# EAGLE schematic moteus_n1 (EAGLE 9.6.0)
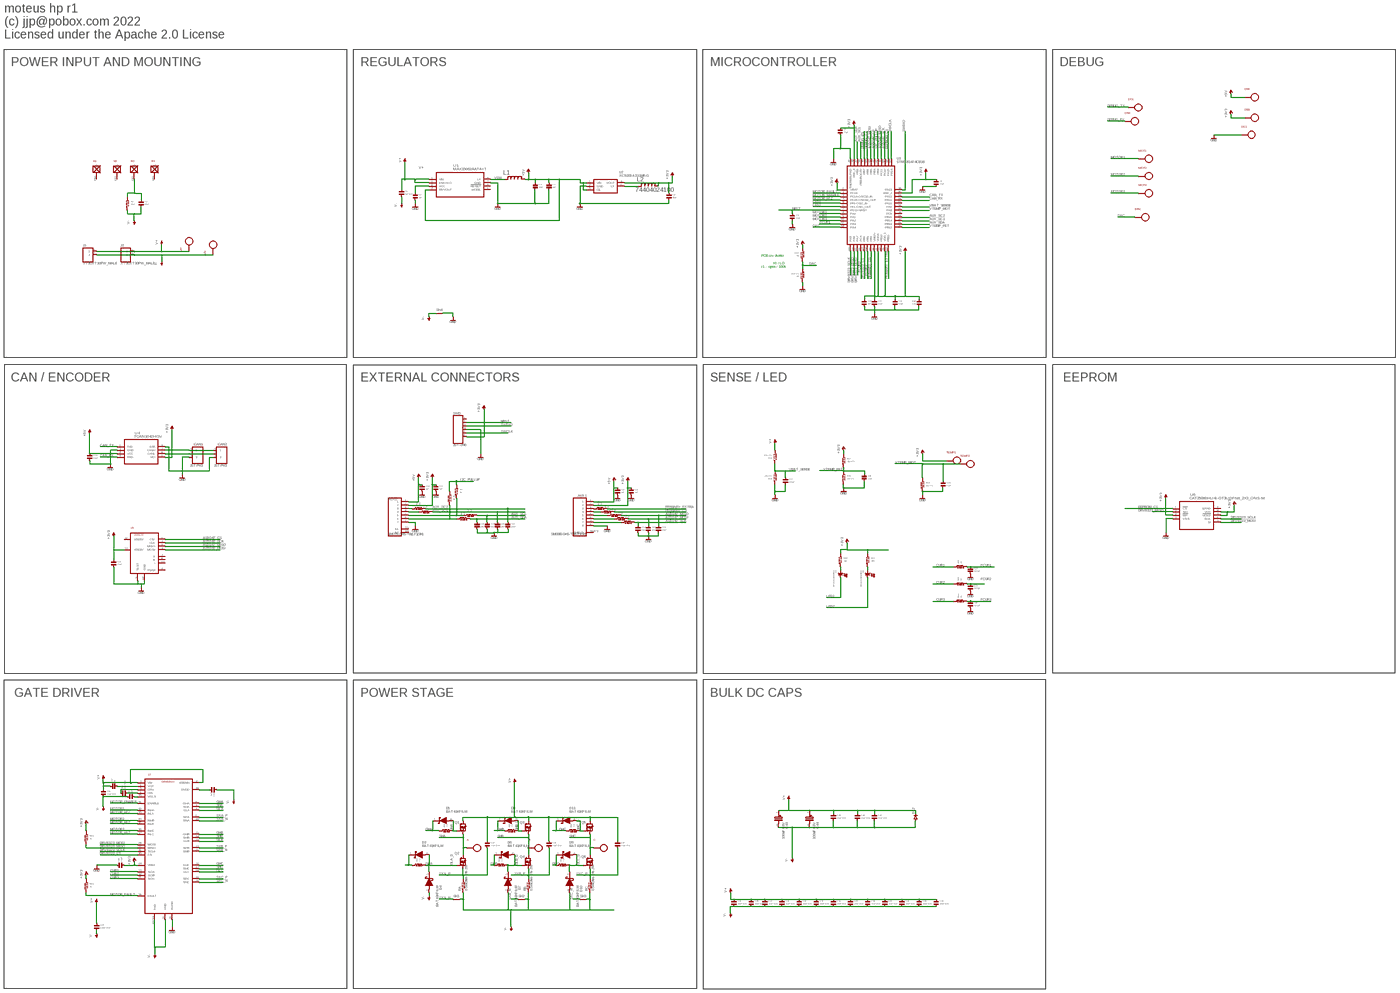
[diagram p0: schematic, sheet 1, overview]
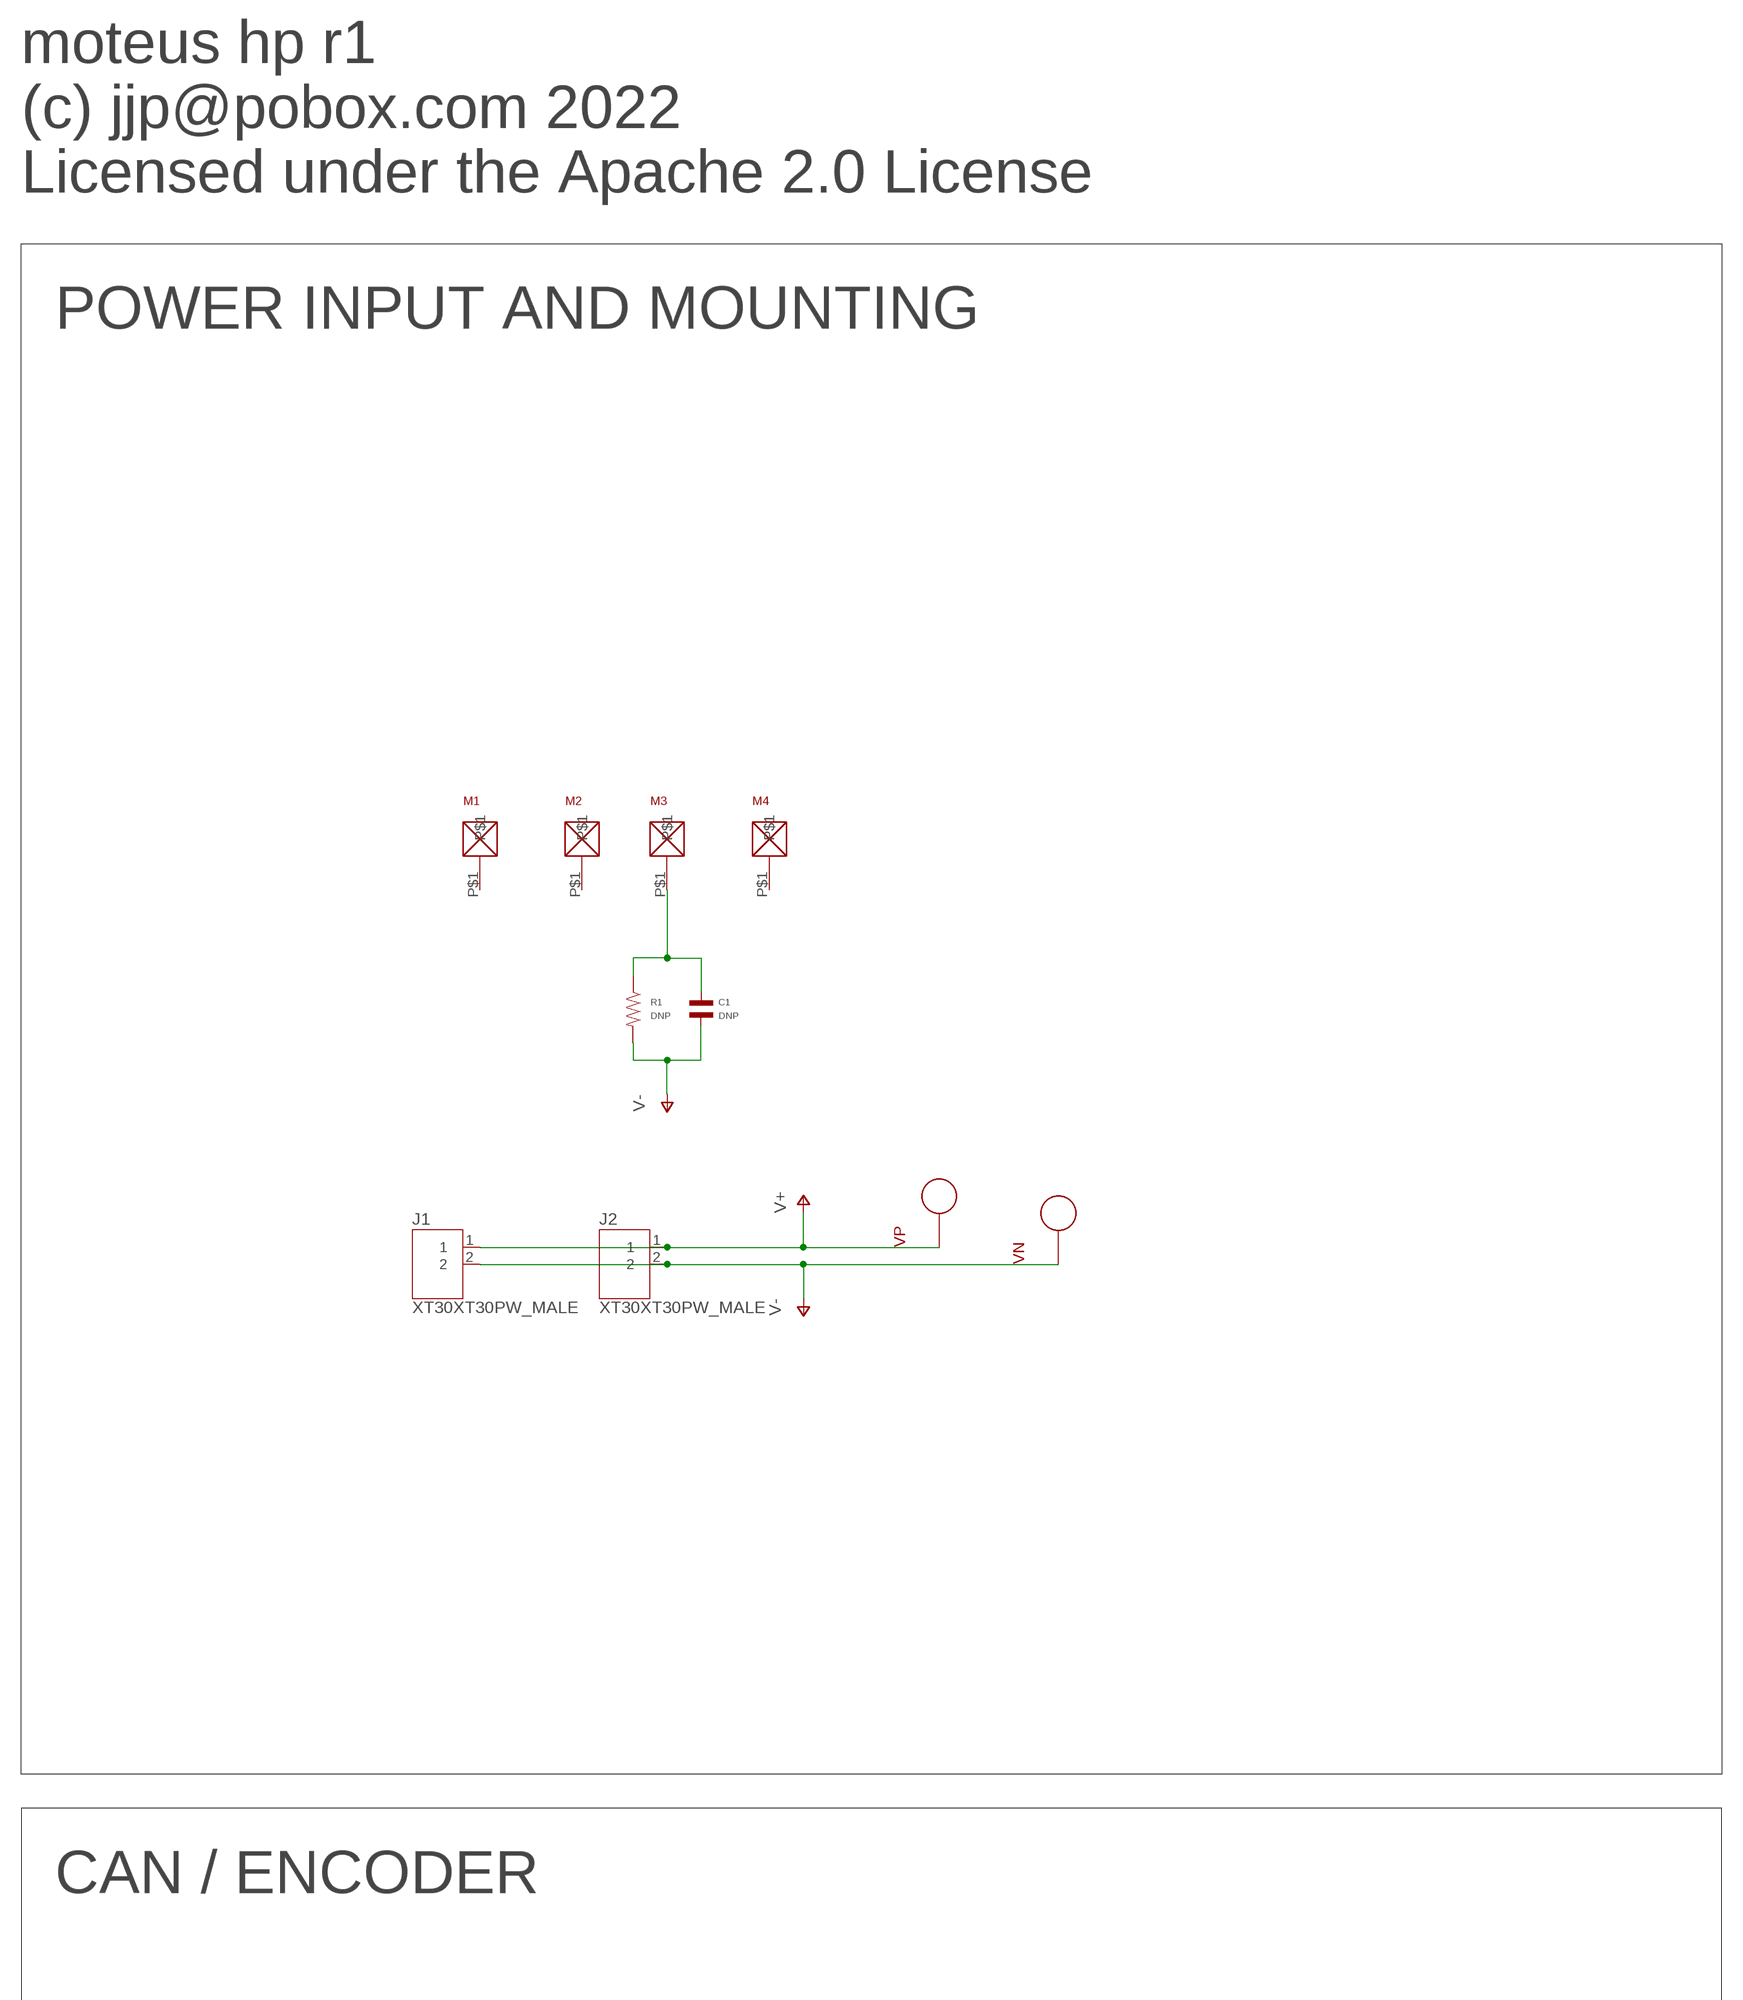
[diagram p1: schematic, sheet 1, part 1 of 8]
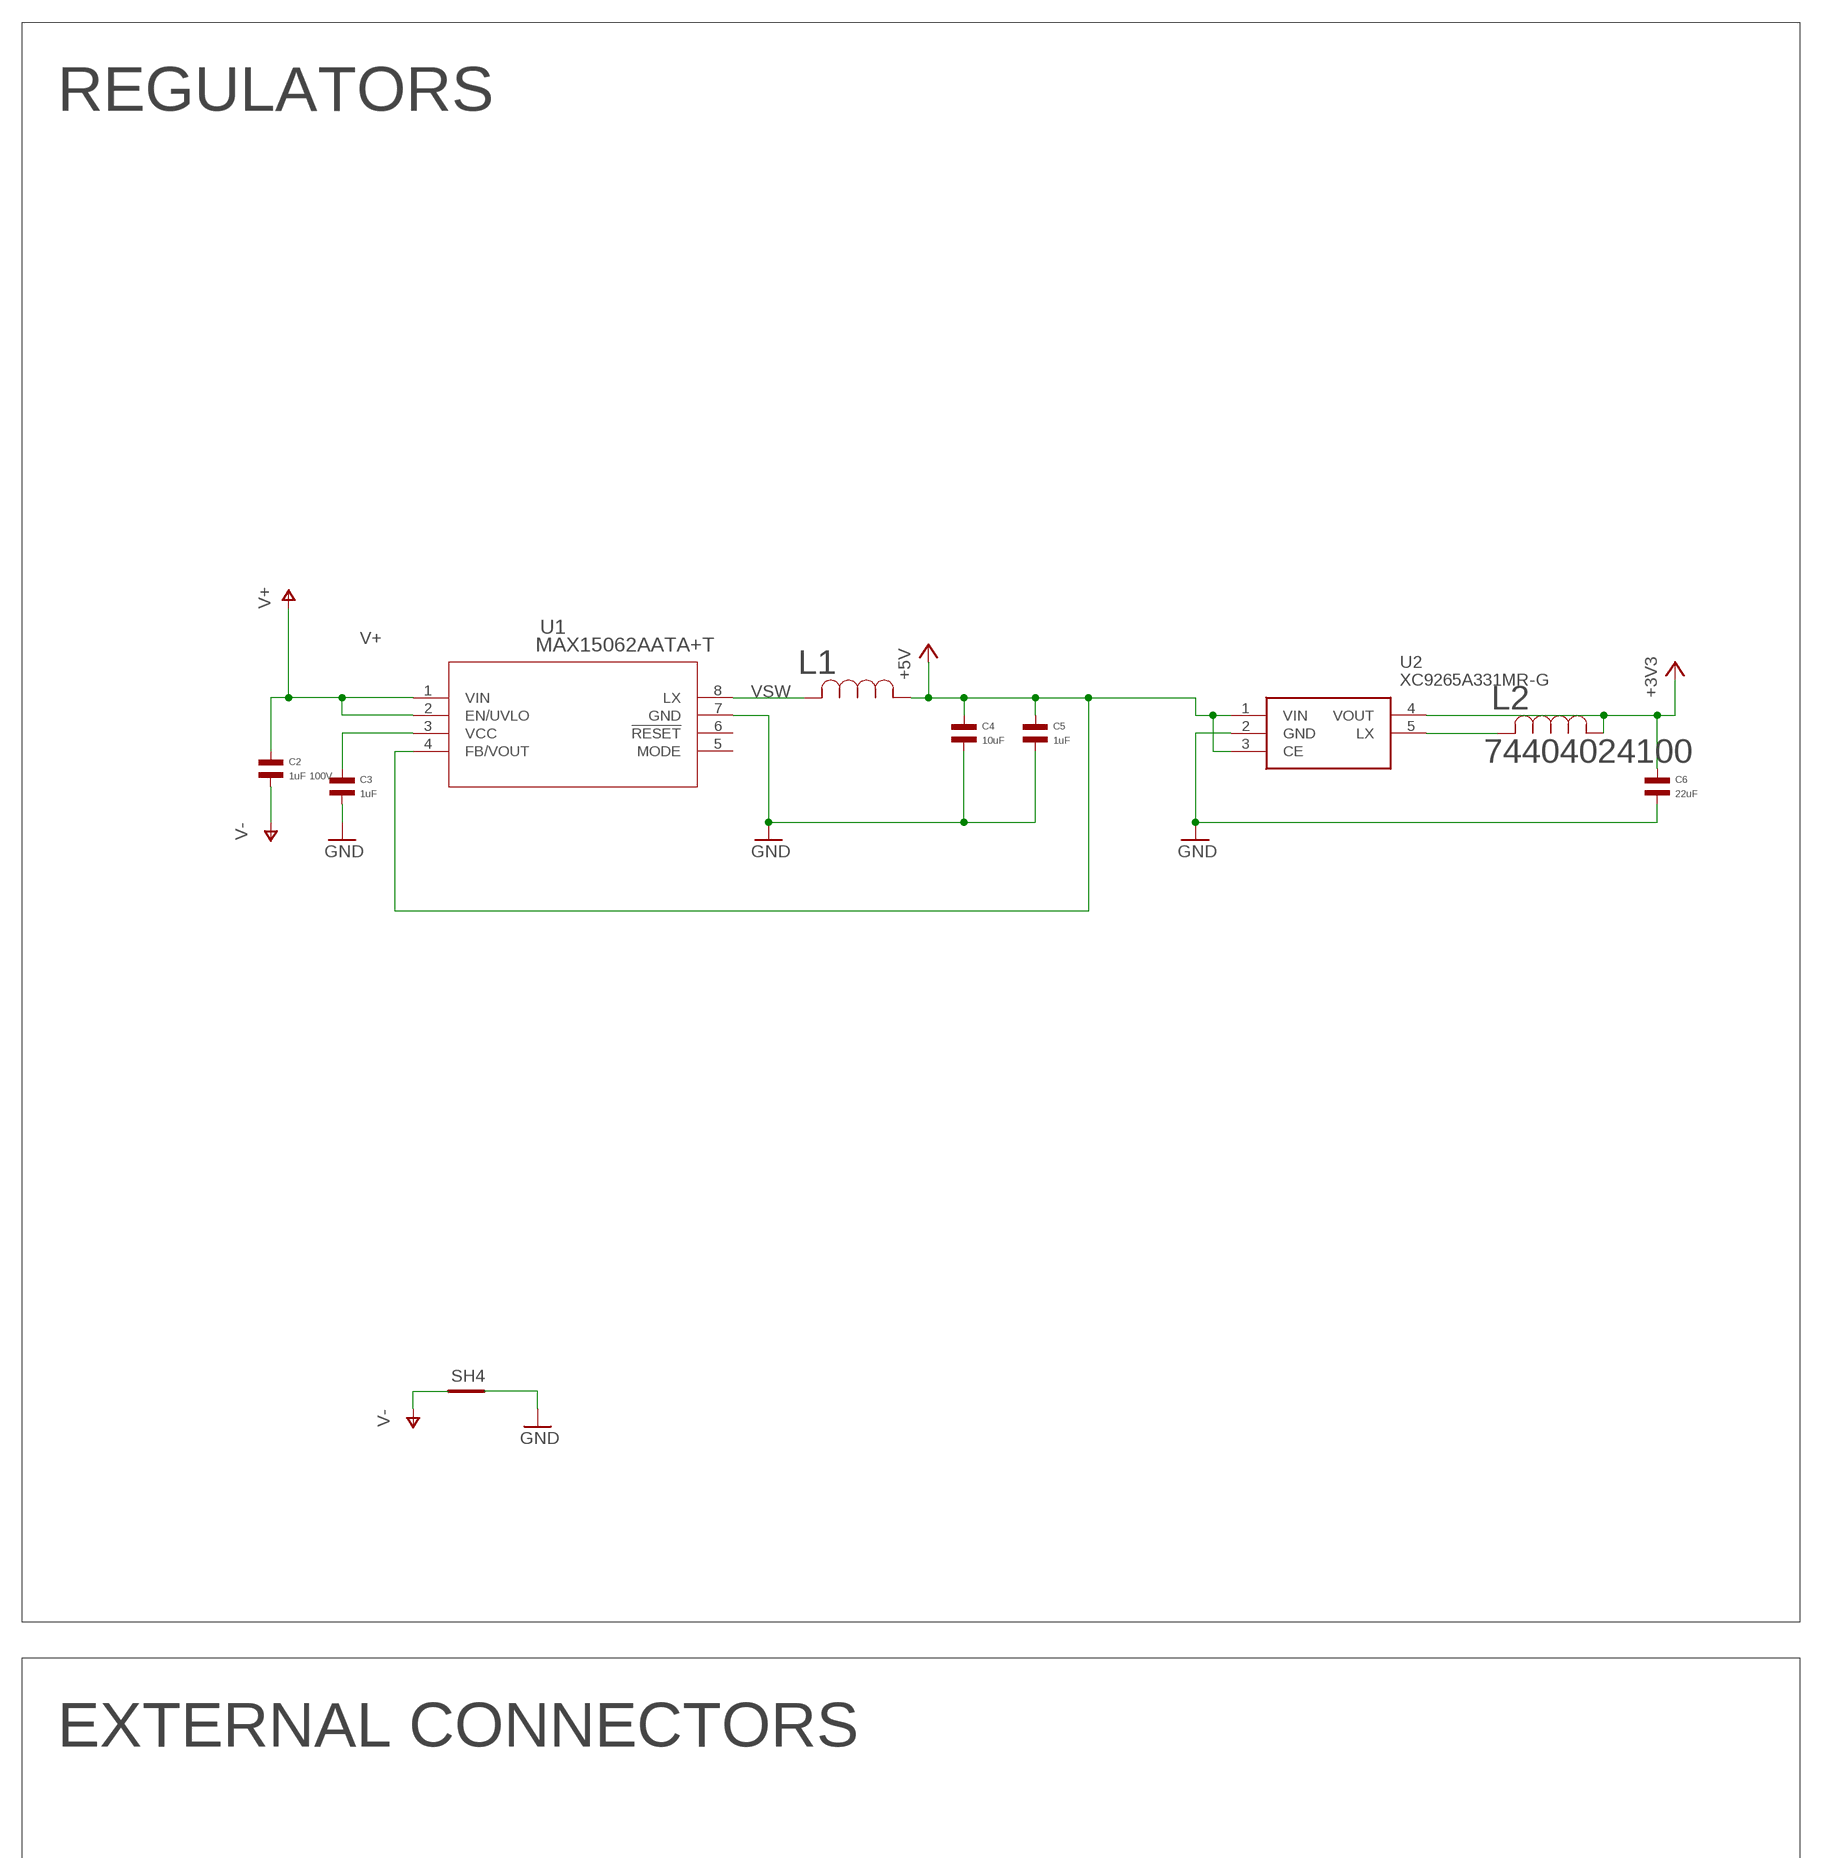
[diagram p2: schematic, sheet 1, part 2 of 8]
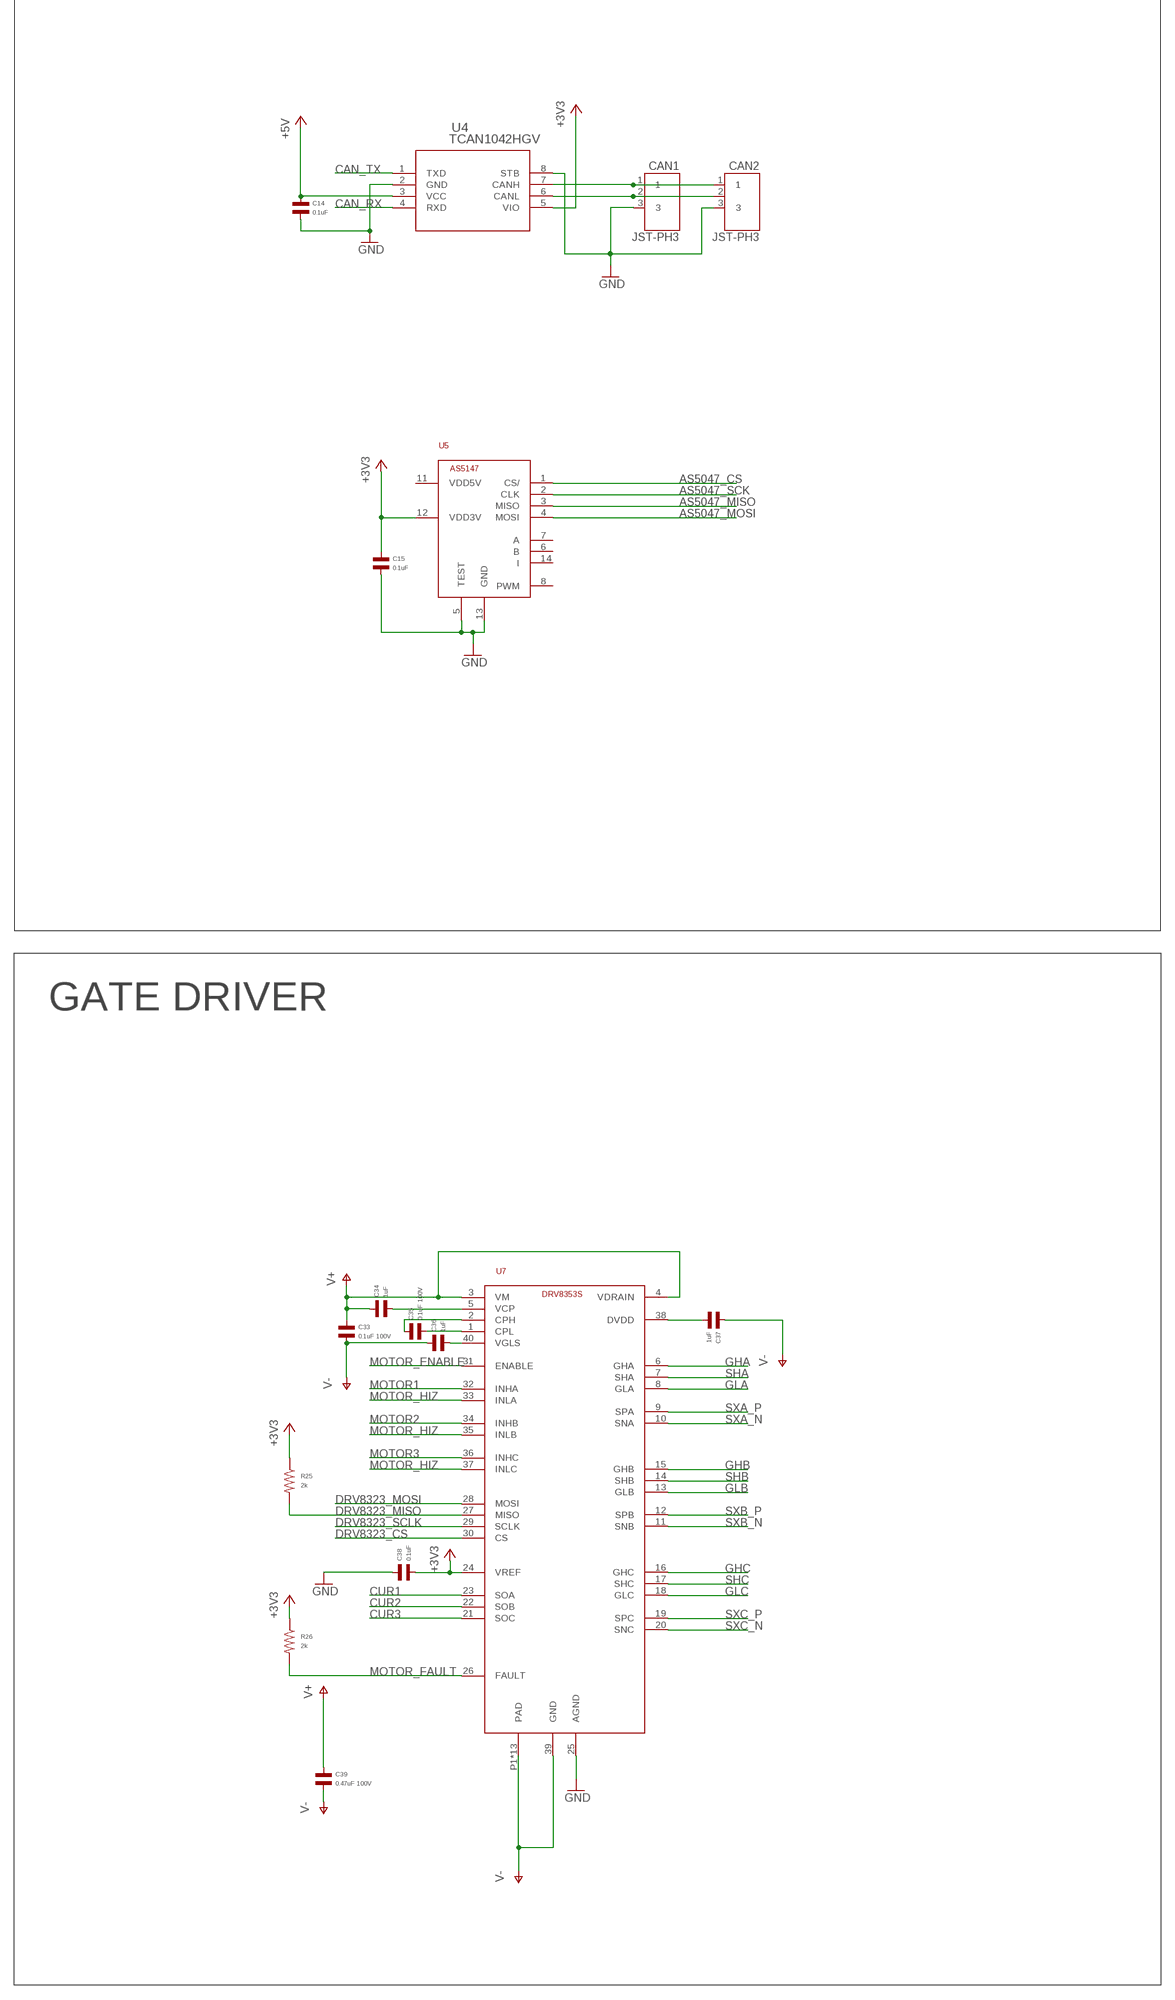
[diagram p3: schematic, sheet 1, part 3 of 8]
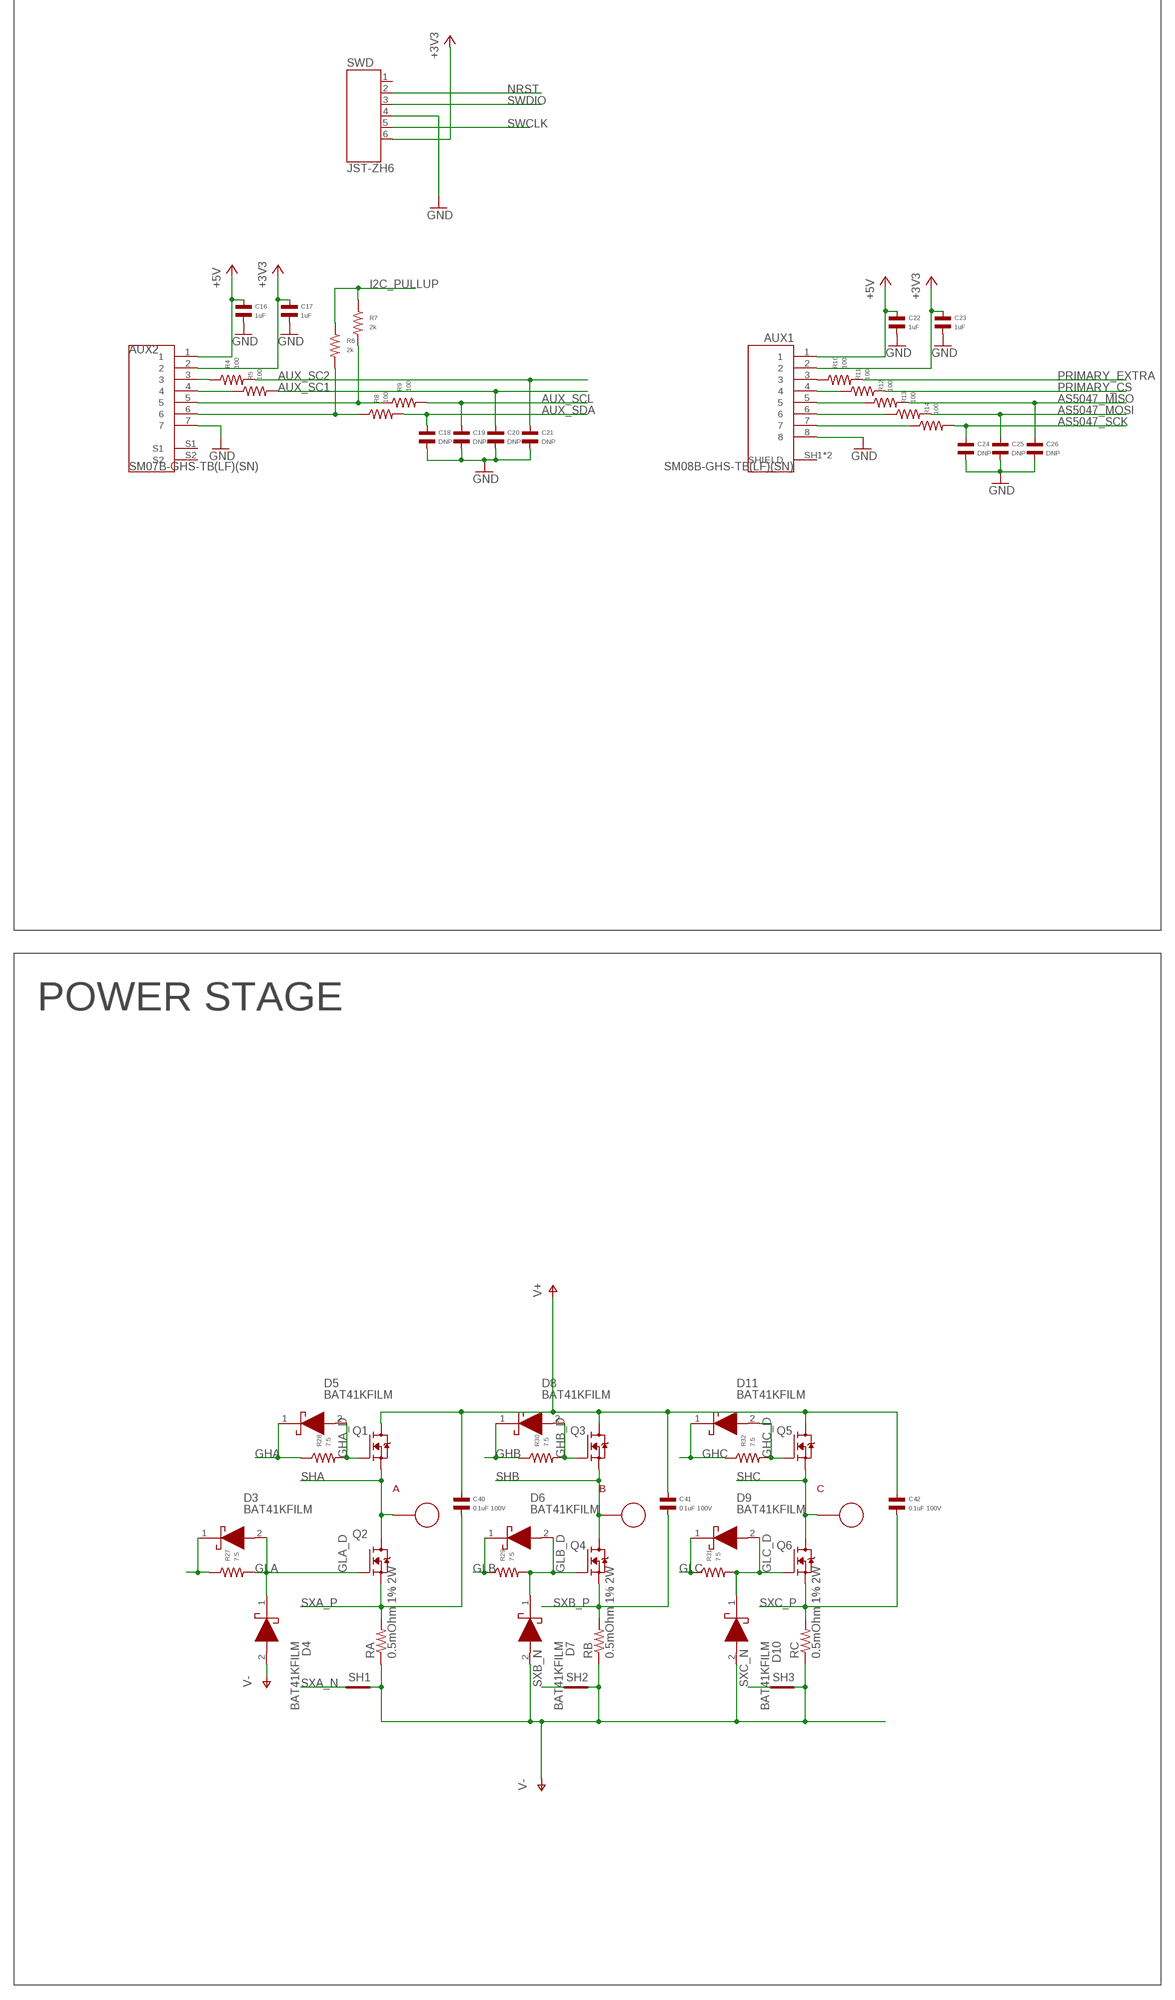
[diagram p4: schematic, sheet 1, part 4 of 8]
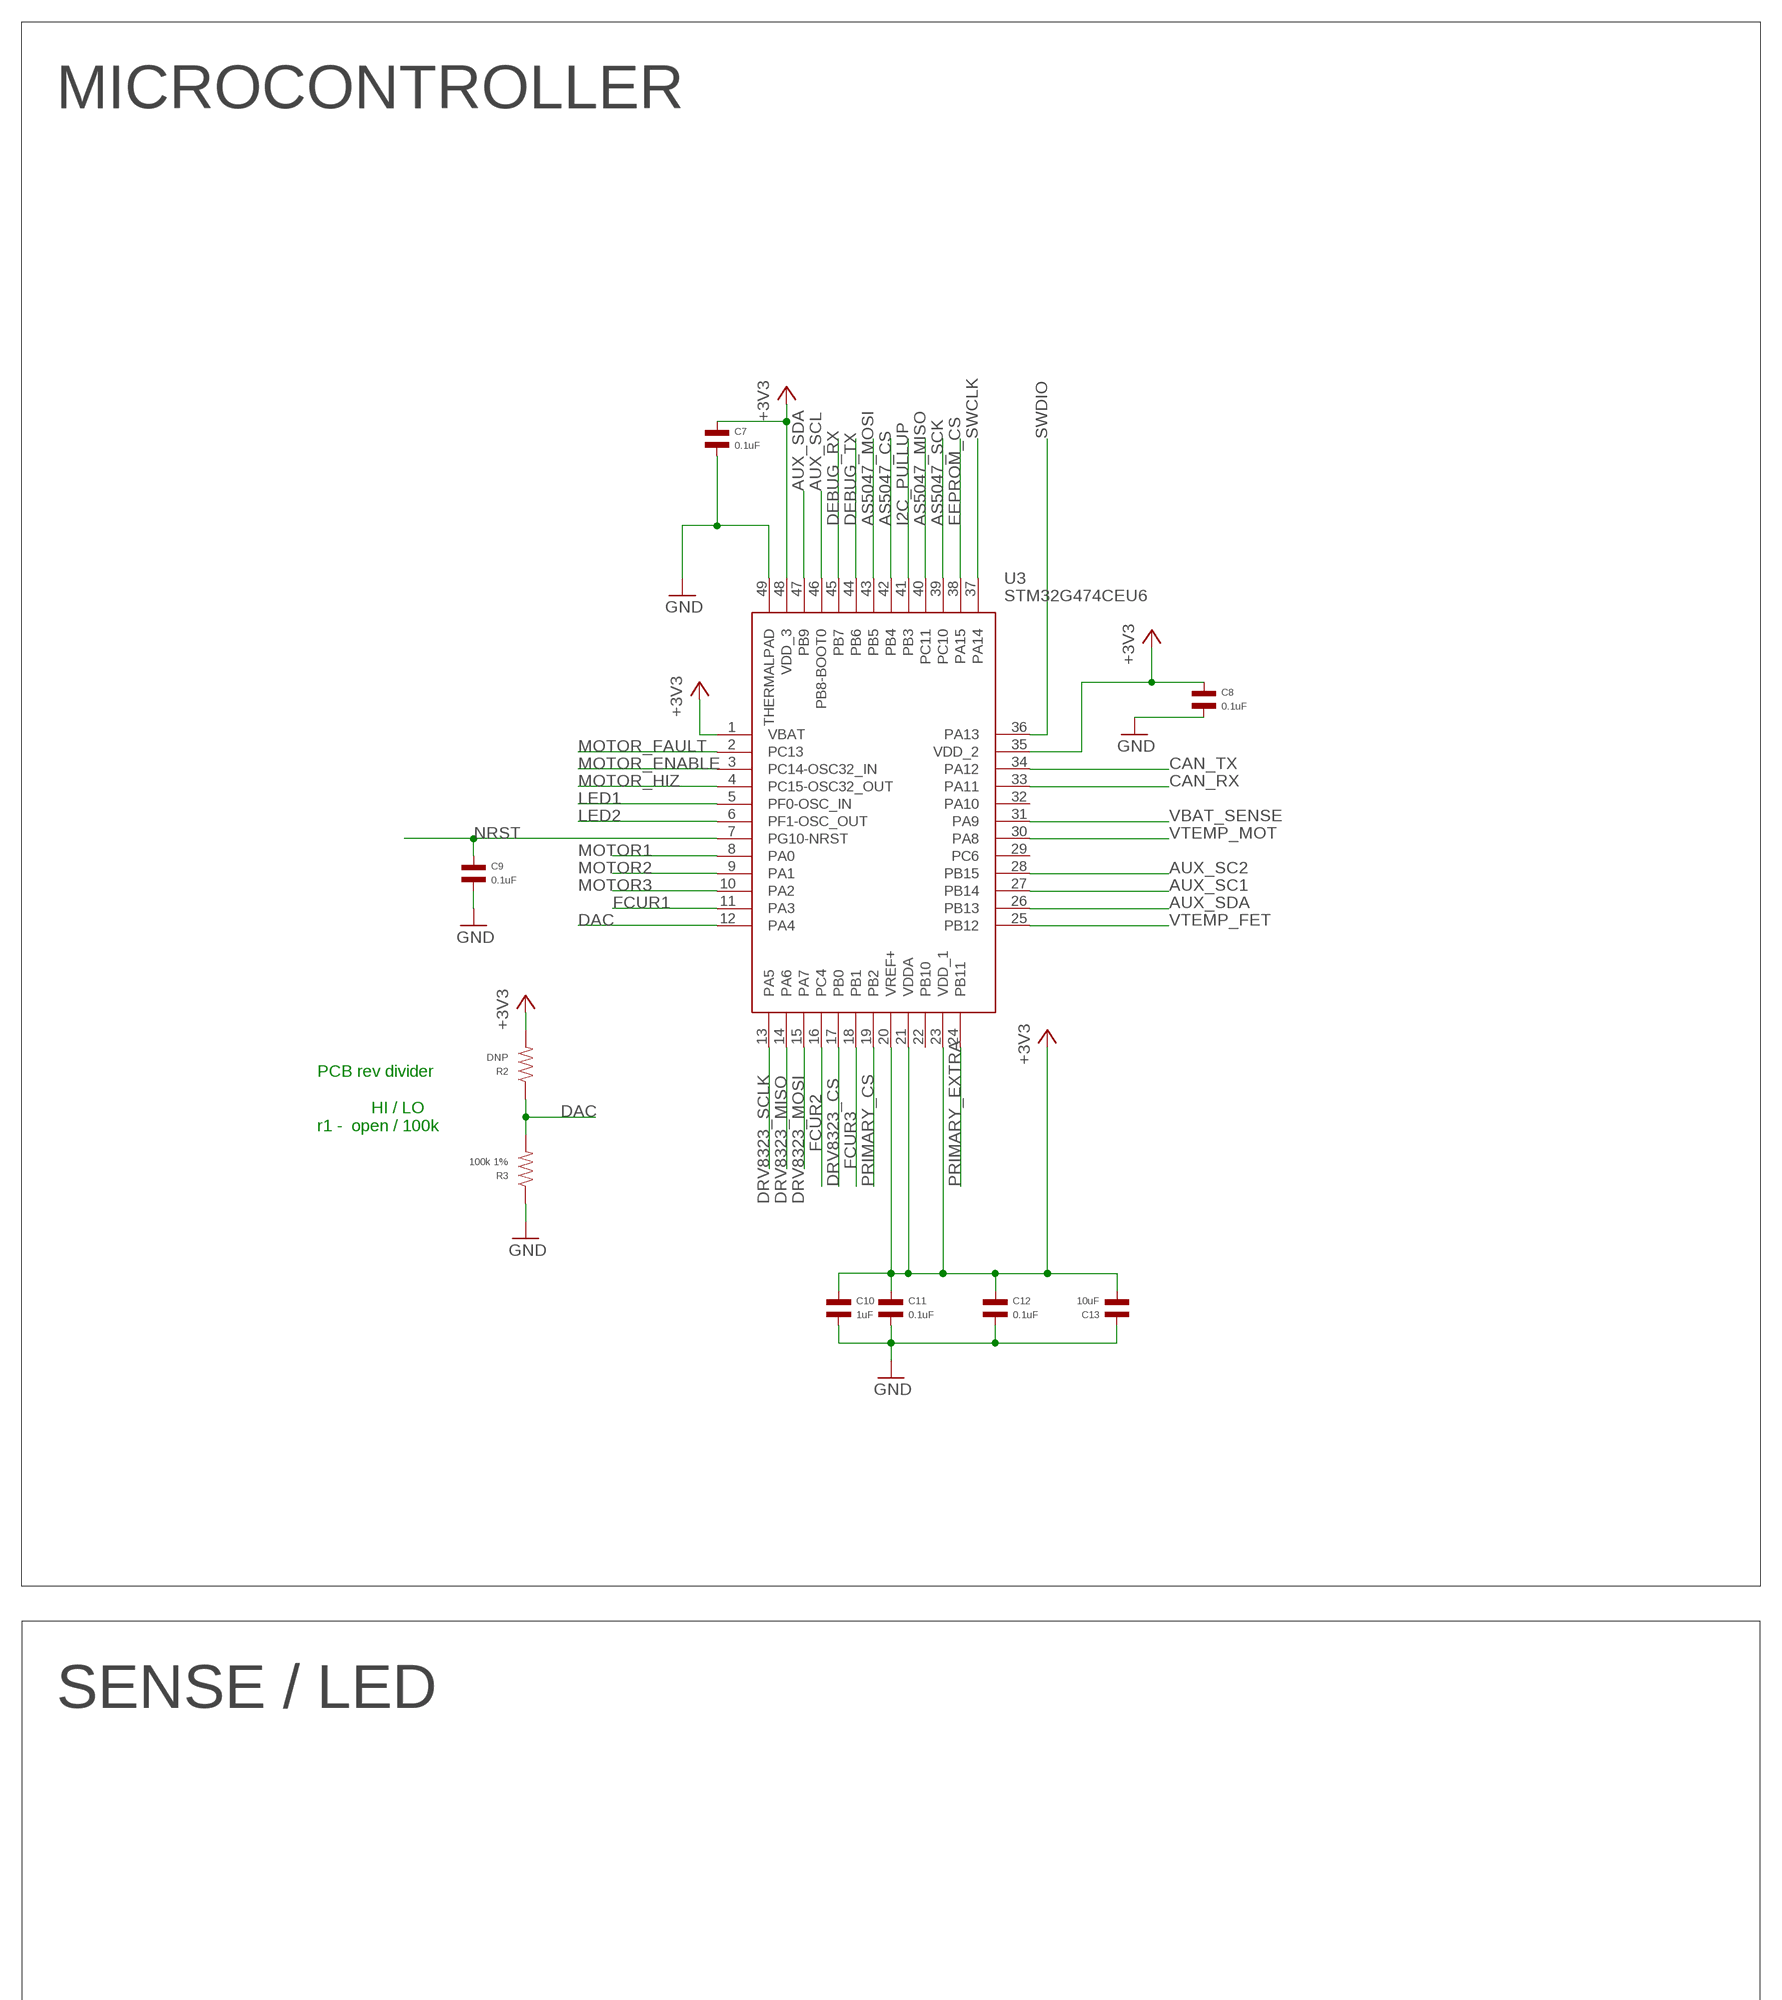
[diagram p5: schematic, sheet 1, part 5 of 8]
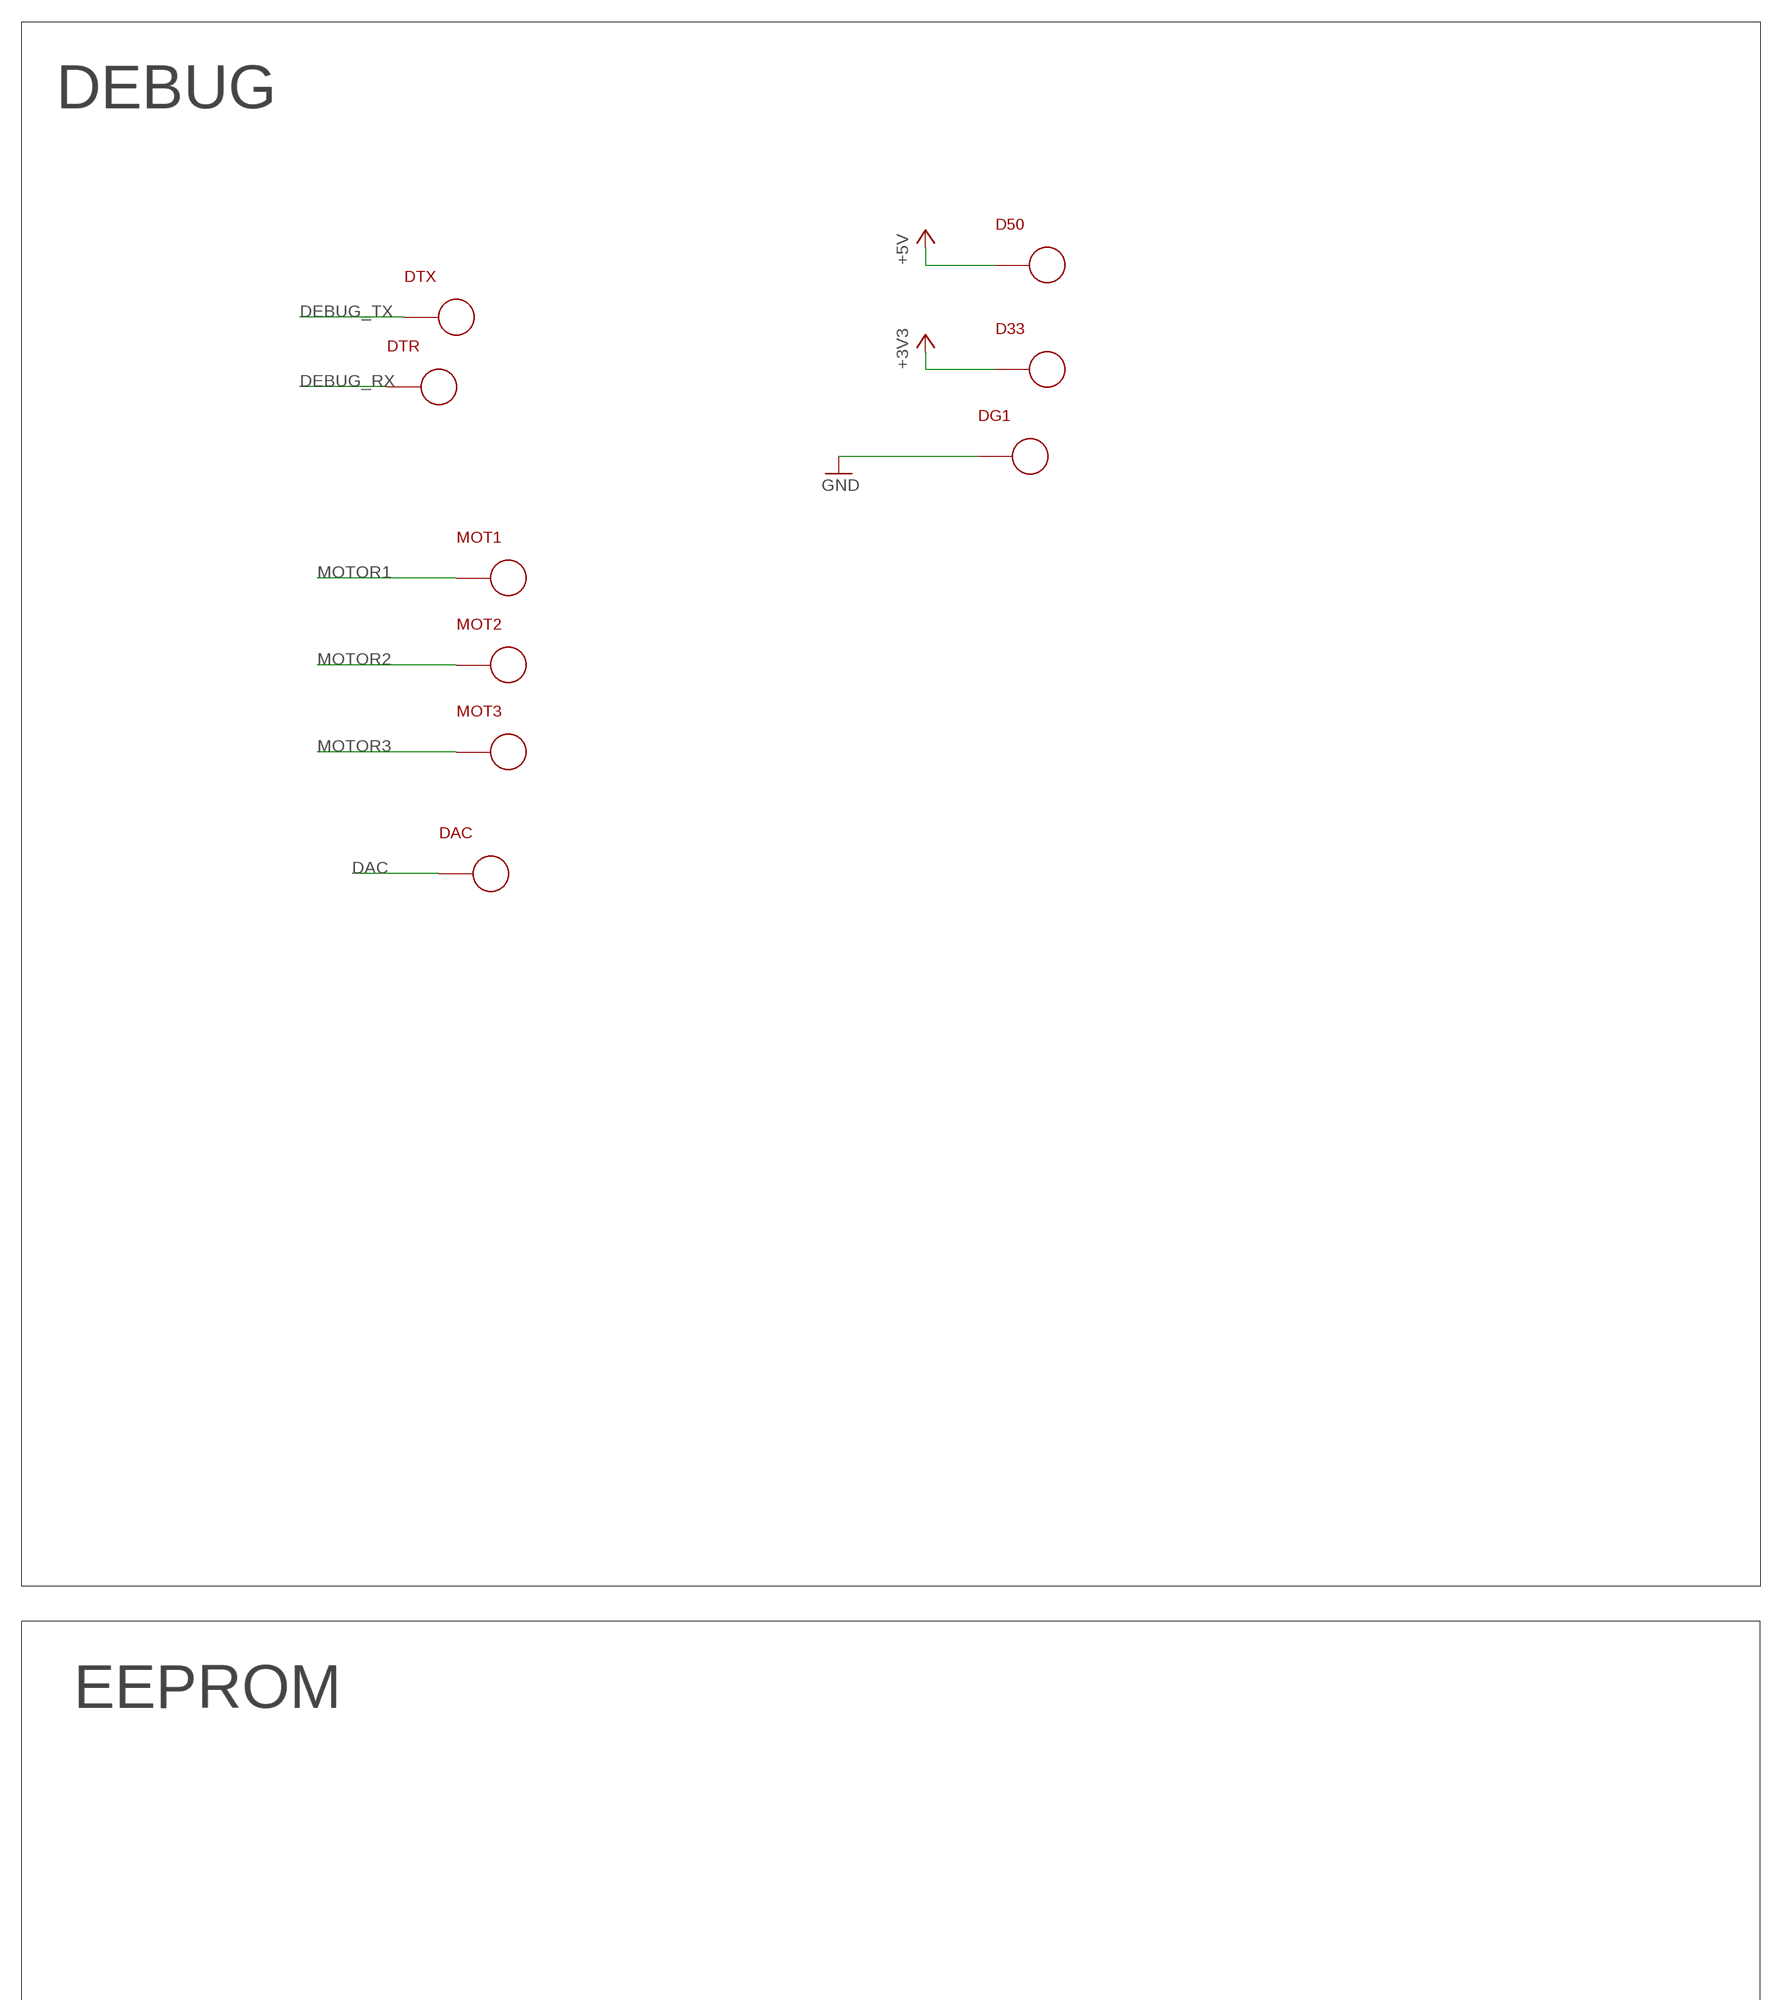
[diagram p6: schematic, sheet 1, part 6 of 8]
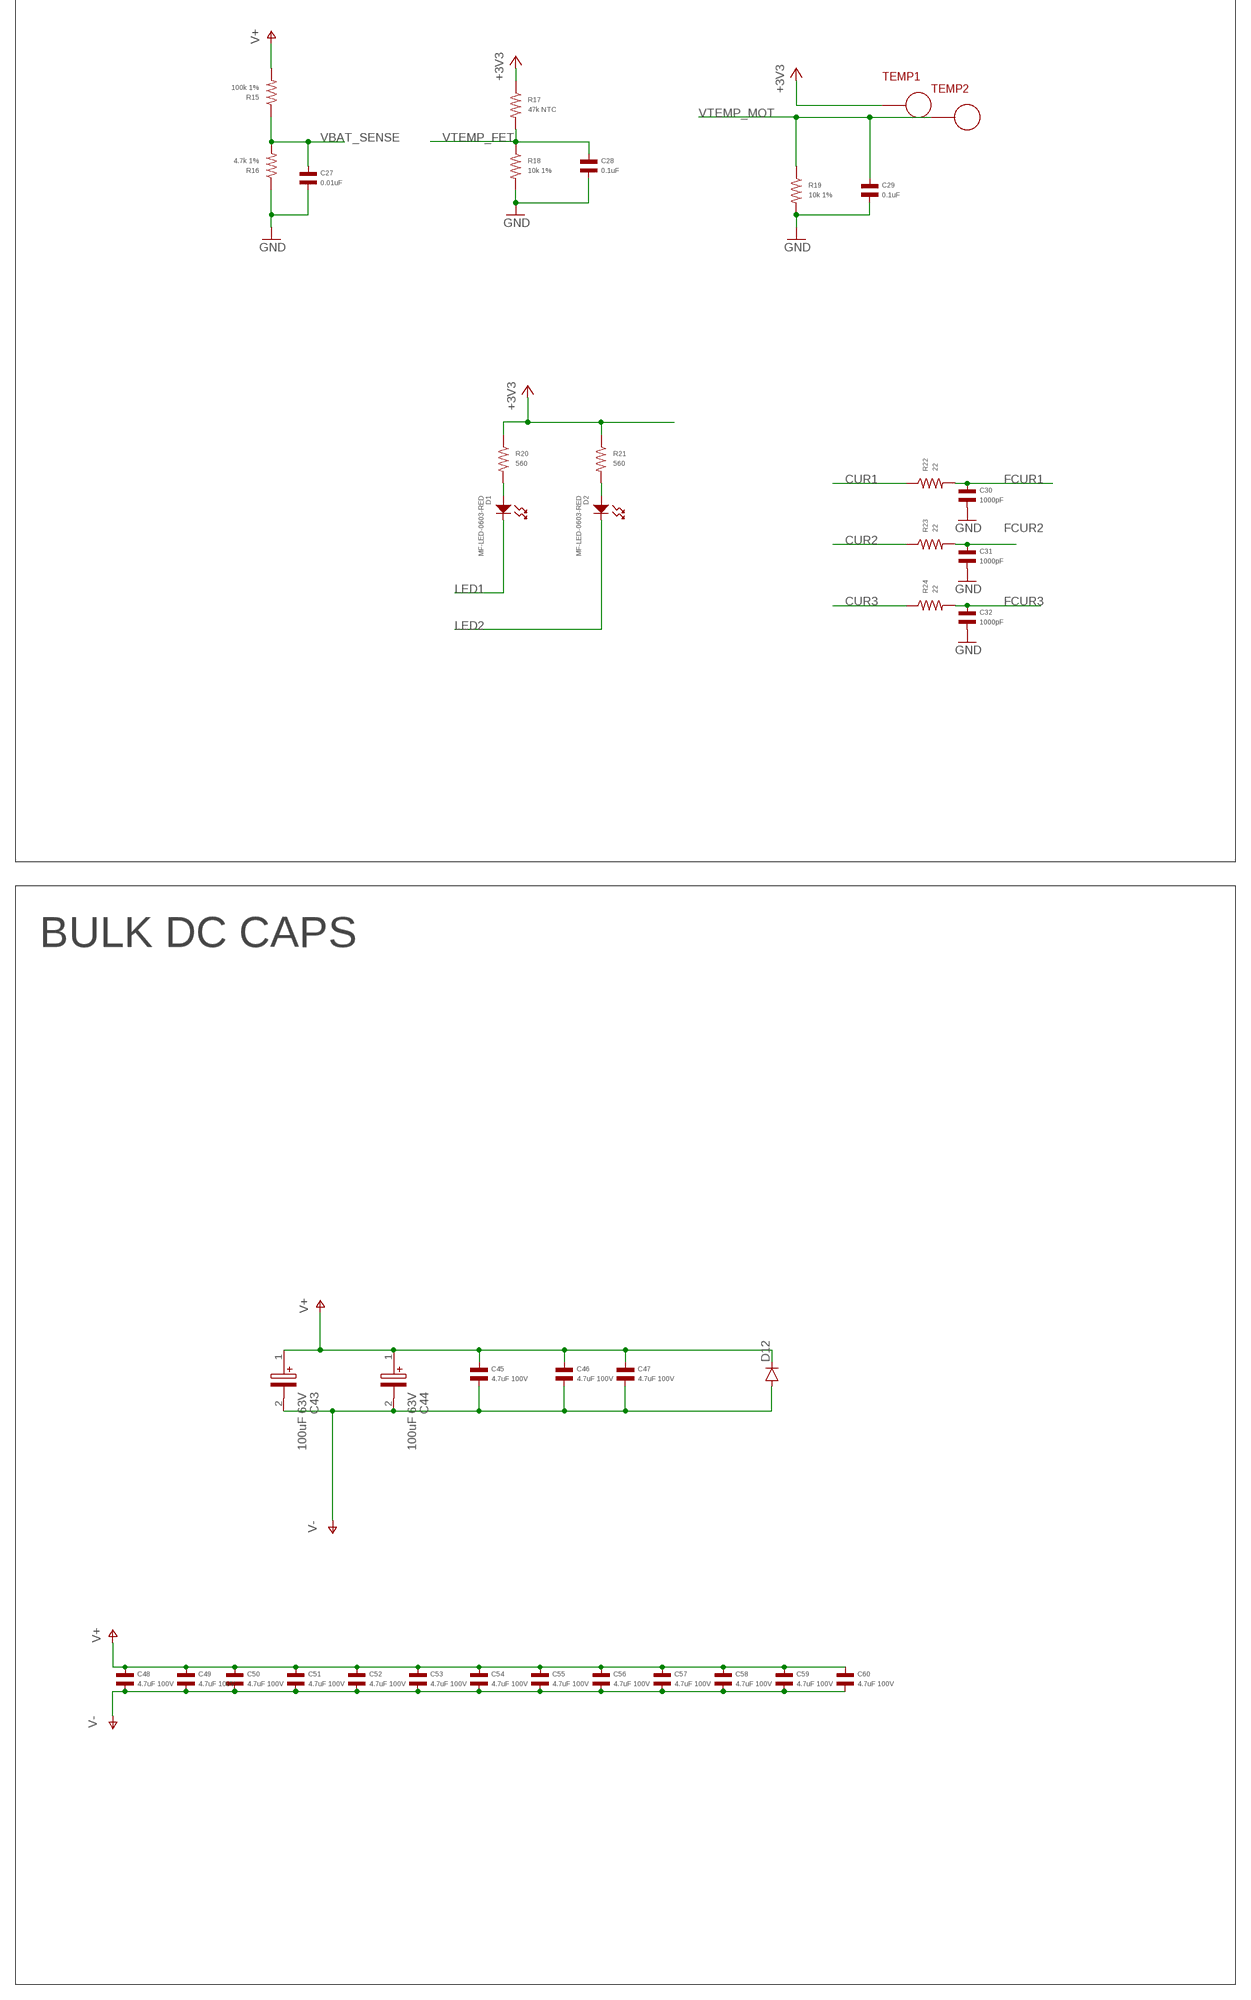
[diagram p7: schematic, sheet 1, part 7 of 8]
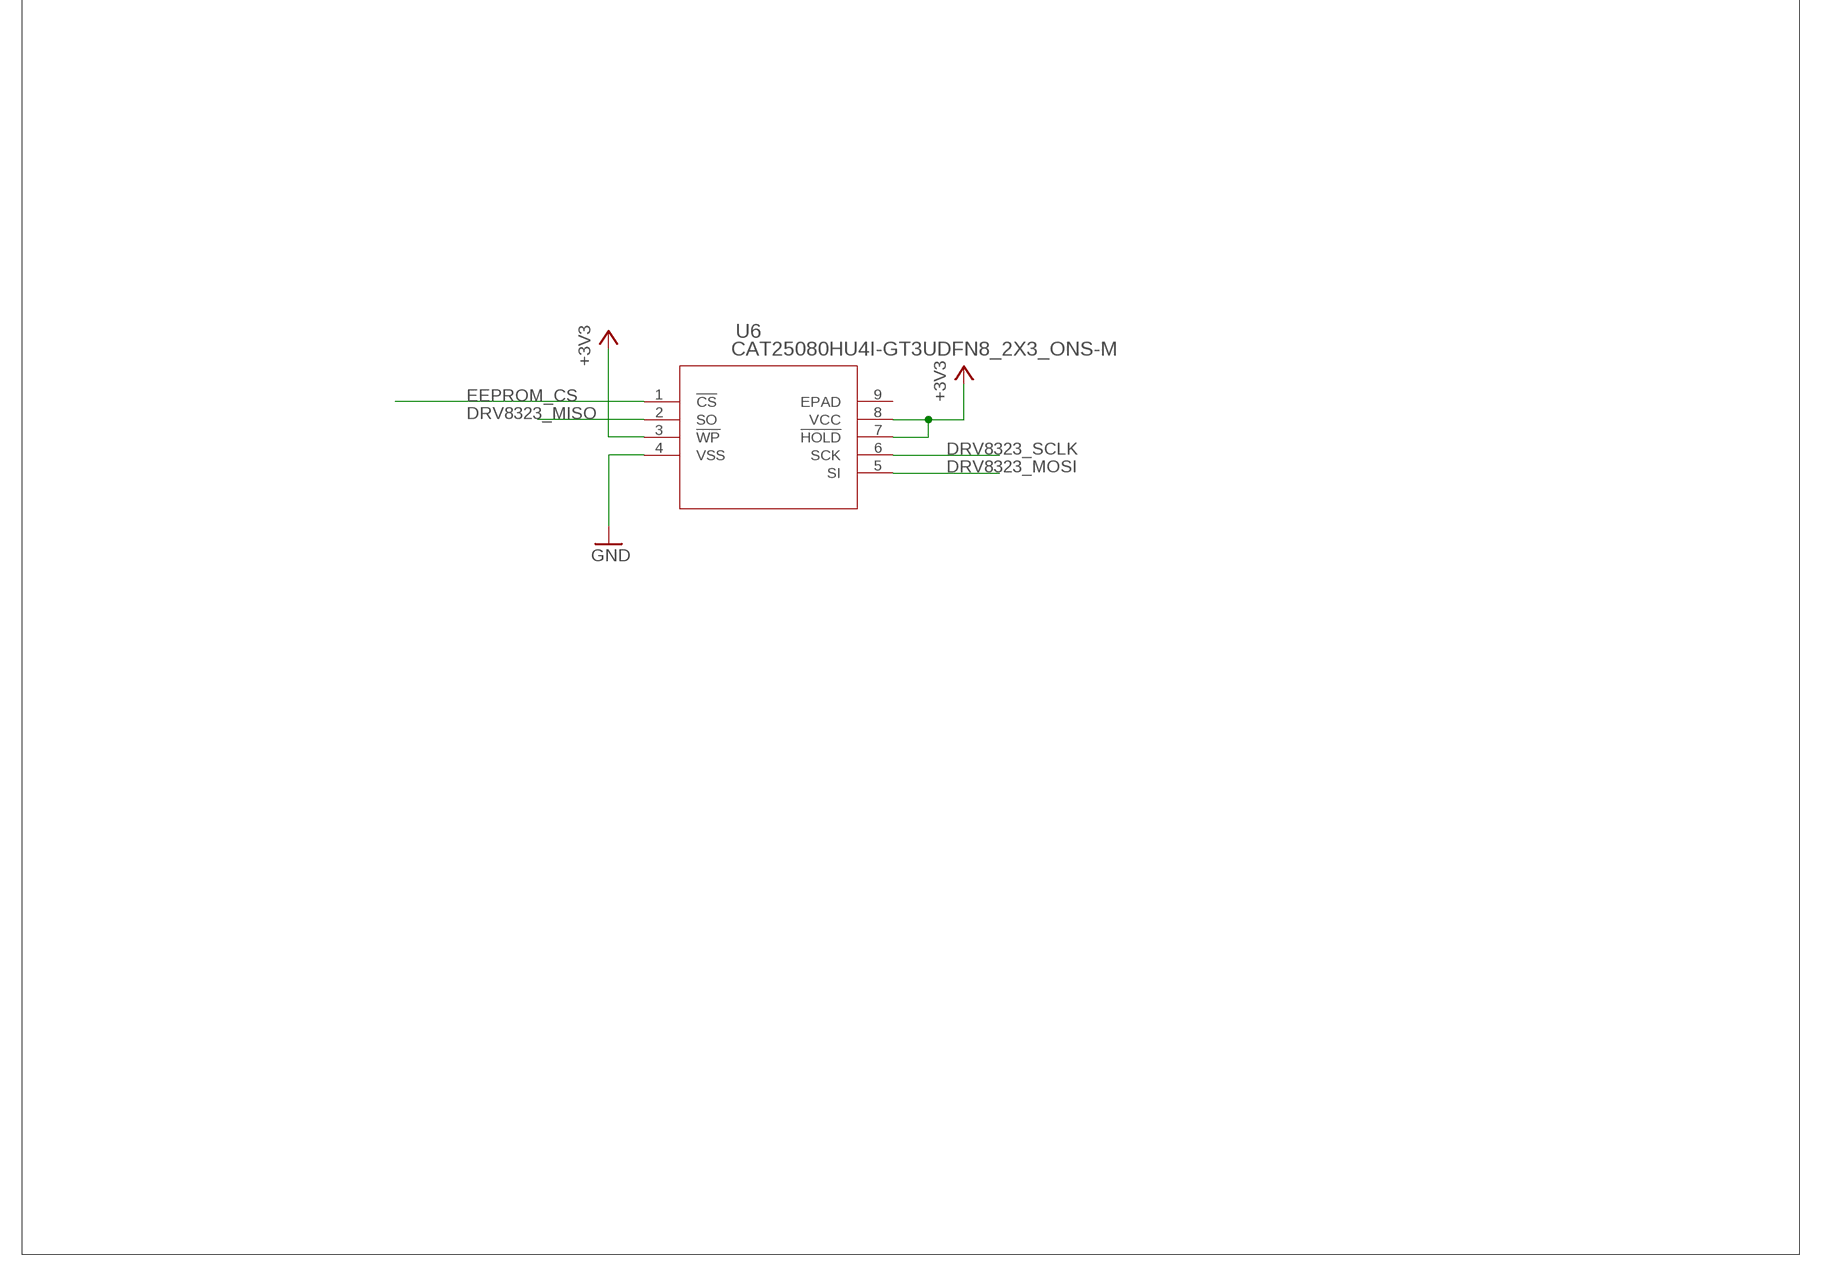
[diagram p8: schematic, sheet 1, part 8 of 8]

## Parts
A  PAD16AWG_TERM  [16AWG_TERM]
AUX1  SM08B-GHS-TB(LF)(SN)  [JST_SM08B-GHS-TB(LF)(SN)]
AUX2  SM07B-GHS-TB(LF)(SN)  [JST_SM07B-GHS-TB(LF)(SN)]
B  PAD16AWG_TERM  [16AWG_TERM]
C  PAD16AWG_TERM  [16AWG_TERM]
C1  DNP  CAPACITOR_NP_0402  [C0402]
C2  1uF 100V  CAPACITOR_NP_0805  [C0805]
C3  1uF  CAPACITOR_NP_0603  [C0603]
C4  10uF  CAPACITOR_NP_1206  [C1206]
C5  1uF  CAPACITOR_NP_0402  [C0402]
C6  22uF  CAPACITOR_NP_1206  [C1206]
C7  0.1uF  CAPACITOR_NP_0402  [C0402]
C8  0.1uF  CAPACITOR_NP_0402  [C0402]
C9  0.1uF  CAPACITOR_NP_0402  [C0402]
C10  1uF  CAPACITOR_NP_0402  [C0402]
C11  0.1uF  CAPACITOR_NP_0402  [C0402]
C12  0.1uF  CAPACITOR_NP_0402  [C0402]
C13  10uF  CAPACITOR_NP_1206  [C1206]
C14  0.1uF  CAPACITOR_NP_0402  [C0402]
C15  0.1uF  CAPACITOR_NP_0402  [C0402]
C16  1uF  CAPACITOR_NP_0603  [C0603]
C17  1uF  CAPACITOR_NP_0603  [C0603]
C18  DNP  CAPACITOR_NP_0402  [C0402]
C19  DNP  CAPACITOR_NP_0402  [C0402]
C20  DNP  CAPACITOR_NP_0402  [C0402]
C21  DNP  CAPACITOR_NP_0402  [C0402]
C22  1uF  CAPACITOR_NP_0603  [C0603]
C23  1uF  CAPACITOR_NP_0603  [C0603]
C24  DNP  CAPACITOR_NP_0402  [C0402]
C25  DNP  CAPACITOR_NP_0402  [C0402]
C26  DNP  CAPACITOR_NP_0402  [C0402]
C27  0.01uF  CAPACITOR_NP_0402  [C0402]
C28  0.1uF  CAPACITOR_NP_0402  [C0402]
C29  0.1uF  CAPACITOR_NP_0402  [C0402]
C30  1000pF  CAPACITOR_NP_0402  [C0402]
C31  1000pF  CAPACITOR_NP_0402  [C0402]
C32  1000pF  CAPACITOR_NP_0402  [C0402]
C33  0.1uF 100V  CAPACITOR_NP_0603  [C0603]
C34  1uF  CAPACITOR_NP_0402  [C0402]
C35  0.1uF 100V  CAPACITOR_NP_0603  [C0603]
C36  1uF  CAPACITOR_NP_0402  [C0402]
C37  1uF  CAPACITOR_NP_0402  [C0402]
C38  0.1uF  CAPACITOR_NP_0402  [C0402]
C39  0.47uF 100V  CAPACITOR_NP_0805  [C0805]
C40  0.1uF 100V  CAPACITOR_NP_1206  [C1206]
C41  0.1uF 100V  CAPACITOR_NP_1206  [C1206]
C42  0.1uF 100V  CAPACITOR_NP_1206  [C1206]
C43  100uF 63V  EEH-ZU1J101P  [EEHZS1V471UP]
C44  100uF 63V  EEH-ZU1J101P  [EEHZS1V471UP]
C45  4.7uF 100V  CAPACITOR_NP_1206  [C1206]
C46  4.7uF 100V  CAPACITOR_NP_1206  [C1206]
C47  4.7uF 100V  CAPACITOR_NP_1206  [C1206]
C48  4.7uF 100V  CAPACITOR_NP_NOCREAM_NOBORDER  [C1206_NOCREAM_NOBORDER]
C49  4.7uF 100V  CAPACITOR_NP_NOCREAM_NOBORDER  [C1206_NOCREAM_NOBORDER]
C50  4.7uF 100V  CAPACITOR_NP_NOCREAM_NOBORDER  [C1206_NOCREAM_NOBORDER]
C51  4.7uF 100V  CAPACITOR_NP_NOCREAM_NOBORDER  [C1206_NOCREAM_NOBORDER]
C52  4.7uF 100V  CAPACITOR_NP_NOCREAM_NOBORDER  [C1206_NOCREAM_NOBORDER]
C53  4.7uF 100V  CAPACITOR_NP_NOCREAM_NOBORDER  [C1206_NOCREAM_NOBORDER]
C54  4.7uF 100V  CAPACITOR_NP_NOCREAM_NOBORDER  [C1206_NOCREAM_NOBORDER]
C55  4.7uF 100V  CAPACITOR_NP_NOCREAM_NOBORDER  [C1206_NOCREAM_NOBORDER]
C56  4.7uF 100V  CAPACITOR_NP_NOCREAM_NOBORDER  [C1206_NOCREAM_NOBORDER]
C57  4.7uF 100V  CAPACITOR_NP_NOCREAM_NOBORDER  [C1206_NOCREAM_NOBORDER]
C58  4.7uF 100V  CAPACITOR_NP_NOCREAM_NOBORDER  [C1206_NOCREAM_NOBORDER]
C59  4.7uF 100V  CAPACITOR_NP_NOCREAM_NOBORDER  [C1206_NOCREAM_NOBORDER]
C60  4.7uF 100V  CAPACITOR_NP_NOCREAM_NOBORDER  [C1206_NOCREAM_NOBORDER]
CAN1  JST-PH3  [JST_S3B-PH-SM4-TB(LF)(SN)]
CAN2  JST-PH3  [JST_S3B-PH-SM4-TB(LF)(SN)]
D1  MF-LED-0603-RED  LED_SINGLE-0603-RED  [LED0603]
D2  MF-LED-0603-RED  LED_SINGLE-0603-RED  [LED0603]
D3  BAT41KFILM  [SODFL1608X70N]
D4  BAT41KFILM  [SODFL1608X70N]
D5  BAT41KFILM  [SODFL1608X70N]
D6  BAT41KFILM  [SODFL1608X70N]
D7  BAT41KFILM  [SODFL1608X70N]
D8  BAT41KFILM  [SODFL1608X70N]
D9  BAT41KFILM  [SODFL1608X70N]
D10  BAT41KFILM  [SODFL1608X70N]
D11  BAT41KFILM  [SODFL1608X70N]
D12  DIODE-DO214AA  [DO214AA]
D33  PAD24AWG_PAD  [24AWG_PAD]
D50  PAD24AWG_PAD  [24AWG_PAD]
DAC  PAD24AWG_PAD  [24AWG_PAD]
DG1  PAD24AWG_PAD  [24AWG_PAD]
DTR  PAD24AWG_PAD  [24AWG_PAD]
DTX  PAD24AWG_PAD  [24AWG_PAD]
J1  XT30XT30PW_MALE  [XT30PW_MALE]
J2  XT30XT30PW_MALE  [XT30PW_MALE]
L1  SRN4018-220M  [IND_BOURNS_SRN4018]
L2  74404024100  [IND_4024100_WRE]
M1  MOUNT  [M2.5MOUNT]
M2  MOUNT  [M2.5MOUNT]
M3  MOUNT  [M2.5MOUNT]
M4  MOUNT  [M2.5MOUNT]
MOT1  PAD24AWG_PAD  [24AWG_PAD]
MOT2  PAD24AWG_PAD  [24AWG_PAD]
MOT3  PAD24AWG_PAD  [24AWG_PAD]
Q1  TPH1R204PL_VIAS  [SOP_ADVANCE_8_VIAS]
Q2  TPH1R204PLSOP_ADVANCE_8  [SOP_ADVANCE_8]
Q3  TPH1R204PL_VIAS  [SOP_ADVANCE_8_VIAS]
Q4  TPH1R204PLSOP_ADVANCE_8  [SOP_ADVANCE_8]
Q5  TPH1R204PL_VIAS  [SOP_ADVANCE_8_VIAS]
Q6  TPH1R204PLSOP_ADVANCE_8  [SOP_ADVANCE_8]
R1  DNP  RESISTOR_0402  [R0402]
R2  DNP  RESISTOR_0402  [R0402]
R3  100k 1%  RESISTOR_0402  [R0402]
R4  100  RESISTOR_0402  [R0402]
R5  100  RESISTOR_0402  [R0402]
R6  2k  RESISTOR_0402  [R0402]
R7  2k  RESISTOR_0402  [R0402]
R8  100  RESISTOR_0402  [R0402]
R9  100  RESISTOR_0402  [R0402]
R10  100  RESISTOR_0402  [R0402]
R11  100  RESISTOR_0402  [R0402]
R12  100  RESISTOR_0402  [R0402]
R13  100  RESISTOR_0402  [R0402]
R14  100  RESISTOR_0402  [R0402]
R15  100k 1%  RESISTOR_0402  [R0402]
R16  4.7k 1%  RESISTOR_0402  [R0402]
R17  47k NTC  RESISTOR_0402  [R0402]
R18  10k 1%  RESISTOR_0402  [R0402]
R19  10k 1%  RESISTOR_0402  [R0402]
R20  560  RESISTOR_0402  [R0402]
R21  560  RESISTOR_0402  [R0402]
R22  22  RESISTOR_0402  [R0402]
R23  22  RESISTOR_0402  [R0402]
R24  22  RESISTOR_0402  [R0402]
R25  2k  RESISTOR_0402  [R0402]
R26  2k  RESISTOR_0402  [R0402]
R27  7.5  RESISTOR_0402  [R0402]
R28  7.5  RESISTOR_0402  [R0402]
R29  7.5  RESISTOR_0805  [R0805]
R30  7.5  RESISTOR_0402  [R0402]
R31  7.5  RESISTOR_0402  [R0402]
R32  7.5  RESISTOR_0402  [R0402]
RA  0.5mOhm 1% 2W  R-US_M1206  [M1206]
RB  0.5mOhm 1% 2W  R-US_M1206  [M1206]
RC  0.5mOhm 1% 2W  R-US_M1206  [M1206]
SH1  SHORTT5  [SHORT_TOP-50]
SH2  SHORTT5  [SHORT_TOP-50]
SH3  SHORTT5  [SHORT_TOP-50]
SH4  SHORTMEDIUM  [SHORT_TOP-MEDIUM]
SWD  JST-ZH6  [JST_S6B-ZR-SM4A-TF(LF)(SN)]
TEMP1  PAD24AWG_PAD  [24AWG_PAD]
TEMP2  PAD24AWG_PAD  [24AWG_PAD]
U1  MAX15062AATA+T  [21-0487A_MXM]
U2  XC9265A331MR-G  [SOT95P280X130-5N]
U3  STM32G474CEU6  [QFN50P700X700X60-49N]
U4  TCAN1042HGV  [SOIC8]
U5  AS5147  [TSSOP14]
U6  CAT25080HU4I-GT3UDFN8_2X3_ONS-M  [UDFN8_2X3_ONS-M]
U7  DRV8353S  [WQFN-40]
VN  PAD16AWG_TERM  [16AWG_TERM]
VP  PAD16AWG_TERM  [16AWG_TERM]

## Nets
+3V3: AUX1.2 AUX2.2 C6.P$1 C7.P$1 C8.P$1 C10.P$1 C11.P$1 C12.P$1 C13.P$2 C15.P$1 C17.P$1 C23.P$1 C38.P$2 D33.P$1 L2.1 R2.P$2 R17.P$1 R20.P$1 R21.P$1 R25.P$1 R26.P$1 SWD.6 TEMP1.P$1 U2.4(VOUT) U3.1(VBAT) U3.20(VREF+) U3.21(VDDA) U3.23(VDD_1) U3.35(VDD_2) U3.48(VDD_3) U4.5(VIO) U5.12(VDD3V) U6.3(!WP) U6.7(!HOLD) U6.8(VCC) U7.24(VREF)
+5V: AUX1.1 AUX2.1 C4.P$1 C5.P$1 C14.P$1 C16.P$1 C22.P$1 D50.P$1 L1.1 U1.4(FB/VOUT) U2.1(VIN) U2.3(CE) U4.3(VCC)
AS5047_CS: U3.42(PB4) U5.1(CS/)
AS5047_MISO: C26.P$1 R12.P$2 U3.40(PC11) U5.3(MISO)
AS5047_MOSI: C25.P$1 R13.P$2 U3.43(PB5) U5.4(MOSI)
AS5047_SCK: C24.P$1 R14.P$2 U3.39(PC10) U5.2(CLK)
AUX_SC1: C20.P$1 R5.P$2 U3.27(PB14)
AUX_SC2: C21.P$1 R4.P$2 U3.28(PB15)
AUX_SCL: C19.P$1 R9.P$2 U3.46(PB8-BOOT0)
AUX_SDA: C18.P$1 R8.P$2 U3.26(PB13) U3.47(PB9)
CAN_N [CAN]: CAN1.2 CAN2.2 U4.6(CANL)
CAN_P [CAN]: CAN1.1 CAN2.1 U4.7(CANH)
CAN_RX: U3.33(PA11) U4.4(RXD)
CAN_TX: U3.34(PA12) U4.1(TXD)
CUR1: R22.P$1 U7.23(SOA)
CUR2: R23.P$1 U7.22(SOB)
CUR3: R24.P$1 U7.21(SOC)
DAC: DAC.P$1 R2.P$1 R3.P$2 U3.12(PA4)
DEBUG_RX: DTR.P$1 U3.45(PB7)
DEBUG_TX: DTX.P$1 U3.44(PB6)
DRV8323_CS: U3.17(PB0) U7.30(CS)
DRV8323_MISO: R25.P$2 U3.14(PA6) U6.2(SO) U7.27(MISO)
DRV8323_MOSI: U3.15(PA7) U6.5(SI) U7.28(MOSI)
DRV8323_SCLK: U3.13(PA5) U6.6(SCK) U7.29(SCLK)
EEPROM_CS: U3.38(PA15) U6.1(!CS)
FCUR1: C30.P$1 R22.P$2 U3.11(PA3)
FCUR2: C31.P$1 R23.P$2 U3.16(PC4)
FCUR3: C32.P$1 R24.P$2 U3.18(PB1)
GHA [GATE]: D5.1(K) R28.P$1 U7.6(GHA)
GHA_D [GATE]: D5.2(A) Q1.4(G) R28.P$2
GHB [GATE]: D8.1(K) R30.P$1 U7.15(GHB)
GHB_D [GATE]: D8.2(A) Q3.4(G) R30.P$2
GHC [GATE]: D11.1(K) R32.P$1 U7.16(GHC)
GHC_D [GATE]: D11.2(A) Q5.4(G) R32.P$2
GLA [GATE]: D3.1(K) R27.P$1 U7.8(GLA)
GLA_D [GATE]: D3.2(A) D4.1(K) Q2.4(G) R27.P$2
GLB [GATE]: D6.1(K) R29.P$1 U7.13(GLB)
GLB_D [GATE]: D6.2(A) D7.1(K) Q4.4(G) R29.P$2
GLC [GATE]: D9.1(K) R31.P$1 U7.18(GLC)
GLC_D [GATE]: D9.2(A) D10.1(K) Q6.4(G) R31.P$2
GND: AUX1.8 AUX2.7 C3.P$2 C4.P$2 C5.P$2 C6.P$2 C7.P$2 C8.P$2 C9.P$2 C10.P$2 C11.P$2 C12.P$2 C13.P$1 C14.P$2 C15.P$2 C16.P$2 C17.P$2 C18.P$2 C19.P$2 C20.P$2 C21.P$2 C22.P$2 C23.P$2 C24.P$2 C25.P$2 C26.P$2 C27.P$2 C28.P$2 C29.P$2 C30.P$2 C31.P$2 C32.P$2 C38.P$1 CAN1.3 CAN2.3 DG1.P$1 R3.P$1 R16.P$1 R18.P$2 R19.P$2 SH4.2 SWD.4 U1.7(GND) U2.2(GND) U3.49(THERMALPAD) U4.2(GND) U4.8(STB) U5.5(TEST) U5.13(GND) U6.4(VSS) U7.25(AGND)
I2C_PULLUP: R6.P$1 R7.P$1 U3.41(PB3)
LED1: D1.CATHODE U3.5(PF0-OSC_IN)
LED2: D2.CATHODE U3.6(PF1-OSC_OUT)
MOTOR1: MOT1.P$1 U3.8(PA0) U7.32(INHA)
MOTOR2: MOT2.P$1 U3.9(PA1) U7.34(INHB)
MOTOR3: MOT3.P$1 U3.10(PA2) U7.36(INHC)
MOTOR_ENABLE: U3.3(PC14-OSC32_IN) U7.31(ENABLE)
MOTOR_FAULT: R26.P$2 U3.2(PC13) U7.26(FAULT)
MOTOR_HIZ: U3.4(PC15-OSC32_OUT) U7.33(INLA) U7.35(INLB) U7.37(INLC)
N$1: C1.P$1 M3.P$1 R1.P$1
N$2: C36.P$2 U7.40(VGLS)
N$3: AUX2.3 R4.P$1
N$4: C3.P$1 U1.3(VCC)
N$5: L2.2 U2.5(LX)
N$6: AUX2.4 R5.P$1
N$7: AUX2.6 R6.P$2 R8.P$1
N$8: AUX2.5 R7.P$2 R9.P$1
N$9: AUX1.3 R10.P$1
N$10: C35.P$2 U7.1(CPL)
N$11: AUX1.4 R11.P$1
N$12: AUX1.5 R12.P$1
N$13: C35.P$1 U7.2(CPH)
N$14: C34.P$2 U7.5(VCP)
N$15: AUX1.6 R13.P$1
N$16: C37.P$2 U7.38(DVDD)
N$17: D1.ANODE R20.P$2
N$18: D2.ANODE R21.P$2
N$19: AUX1.7 R14.P$1
NRST: C9.P$1 SWD.2 U3.7(PG10-NRST)
PRIMARY_CS: R11.P$2 U3.19(PB2)
PRIMARY_EXTRA: R10.P$2 U3.24(PB11)
SHA [HV]: A.1 A.2 A.3 A.4 A.5 A.6 A.7 A.8 A.9 A.10 A.11 A.12 Q1.1(S) Q1.2(S) Q1.3(S) Q2.5(D) Q2.6(D) Q2.7(D) Q2.8(D) Q2.PAD(D) U7.7(SHA)
SHB [HV]: B.1 B.2 B.3 B.4 B.5 B.6 B.7 B.8 B.9 B.10 B.11 B.12 Q3.1(S) Q3.2(S) Q3.3(S) Q4.5(D) Q4.6(D) Q4.7(D) Q4.8(D) Q4.PAD(D) U7.14(SHB)
SHC [HV]: C.1 C.2 C.3 C.4 C.5 C.6 C.7 C.8 C.9 C.10 C.11 C.12 Q5.1(S) Q5.2(S) Q5.3(S) Q6.5(D) Q6.6(D) Q6.7(D) Q6.8(D) Q6.PAD(D) U7.17(SHC)
SWCLK: SWD.5 U3.37(PA14)
SWDIO: SWD.3 U3.36(PA13)
SXA_N: SH1.1 U7.10(SNA)
SXA_P: C40.P$2 Q2.1(S) Q2.2(S) Q2.3(S) RA.2 U7.9(SPA)
SXB_N: SH2.1 U7.11(SNB)
SXB_P: C41.P$2 Q4.1(S) Q4.2(S) Q4.3(S) RB.2 U7.12(SPB)
SXC_N: SH3.1 U7.20(SNC)
SXC_P: C42.P$2 Q6.1(S) Q6.2(S) Q6.3(S) RC.2 U7.19(SPC)
V+: C2.P$1 C33.P$1 C34.P$1 C39.P$1 C40.P$1 C41.P$1 C42.P$1 C43.1(+) C44.1(+) C45.P$1 C46.P$1 C47.P$1 C48.P$1 C49.P$1 C50.P$1 C51.P$1 C52.P$1 C53.P$1 C54.P$1 C55.P$1 C56.P$1 C57.P$1 C58.P$1 C59.P$1 C60.P$1 D12.C J1.1 J2.1 Q1.5(D) Q1.6(D) Q1.7(D) Q1.8(D) Q1.PAD(D) Q3.5(D) Q3.6(D) Q3.7(D) Q3.8(D) Q3.PAD(D) Q5.5(D) Q5.6(D) Q5.7(D) Q5.8(D) Q5.PAD(D) R15.P$2 U1.1(VIN) U1.2(EN/UVLO) U7.3(VM) U7.4(VDRAIN) VP.1 VP.2 VP.3 VP.4 VP.5 VP.6 VP.7 VP.8 VP.9 VP.10 VP.11 VP.12
V-: C1.P$2 C2.P$2 C33.P$2 C36.P$1 C37.P$1 C39.P$2 C43.2(-) C44.2(-) C45.P$2 C46.P$2 C47.P$2 C48.P$2 C49.P$2 C50.P$2 C51.P$2 C52.P$2 C53.P$2 C54.P$2 C55.P$2 C56.P$2 C57.P$2 C58.P$2 C59.P$2 C60.P$2 D4.2(A) D7.2(A) D10.2(A) D12.A J1.2 J2.2 R1.P$2 RA.1 RB.1 RC.1 SH1.2 SH2.2 SH3.2 SH4.1 U7.39(GND) U7.P1(PAD) U7.P2(PAD) U7.P3(PAD) U7.P7(PAD) U7.P8(PAD) U7.P9(PAD) U7.P12(PAD) U7.P13(PAD) U7.P14(PAD) U7.P17(PAD) U7.P18(PAD) U7.P19(PAD) U7.PAD VN.1 VN.2 VN.3 VN.4 VN.5 VN.6 VN.7 VN.8 VN.9 VN.10 VN.11 VN.12
VBAT_SENSE: C27.P$1 R15.P$1 R16.P$2 U3.31(PA9)
VSW: L1.2 U1.8(LX)
VTEMP_FET: C28.P$1 R17.P$2 R18.P$1 U3.25(PB12)
VTEMP_MOT: C29.P$1 R19.P$1 TEMP2.P$1 U3.30(PA8)
Unconnected: AUX1.SH1(SHIELD) AUX1.SH2(SHIELD) M1.P$1 M2.P$1 M4.P$1 SWD.1 U1.5(MODE) U1.6(!RESET) U3.22(PB10) U3.29(PC6) U3.32(PA10) U5.6(B) U5.7(A) U5.8(PWM) U5.11(VDD5V) U5.14(I) U6.9(EPAD)

## Notes on the sheet
- moteus hp r1
  (c) jjp@pobox.com 2022
  Licensed under the Apache 2.0 License
- POWER INPUT AND MOUNTING | REGULATORS | MICROCONTROLLER | DEBUG
- PCB rev divider
  
              HI / LO
  r1 -  open / 100k
- CAN / ENCODER | EXTERNAL CONNECTORS | SENSE / LED | EEPROM
- GATE DRIVER | POWER STAGE | BULK DC CAPS

## Power pins joined to a net without a drawn wire
S1: AUX2.S1
S2: AUX2.S2

## Library data of the parts
A B C VN VP = moteus_hp:PAD; POPULATE: 0
AUX1 = SM08B-GHS-TB_LF__SN_:SM08B-GHS-TB(LF)(SN): GH Series 8 Position 1.25 mm Pitch Side Entry Shrouded Header; DESCRIPTION: Connector Header Surface Mount, Right Angle 8 position 0.049 (1.25mm); DIGI-KEY_PART_NUMBER: 455-1570-2-ND; MF: JST Sales; MP: SM08B-GHS-TB(LF)(SN); MPN: SM08B-GHS-TB(LF)(SN); PACKAGE: None; POPULATE: 1; PURCHASE-URL: https://pricing.snapeda.com/search/part/SM08B-GHS-TB(LF)(SN)/?ref=eda
AUX2 = SM07B-GHS-TB_LF__SN_:SM07B-GHS-TB(LF)(SN): Conn Shrouded Header HDR 7 POS 1.25mm Solder RA SMD Reel; DESCRIPTION: Connector Header Surface Mount, Right Angle 7 position 0.049 (1.25mm); DIGI-KEY_PART_NUMBER: 455-1569-2-ND; MF: JST Sales; MP: SM07B-GHS-TB(LF)(SN); MPN: SM07B-GHS-TB(LF)(SN); PACKAGE: None; POPULATE: 1; PURCHASE-URL: https://pricing.snapeda.com/search/part/SM07B-GHS-TB(LF)(SN)/?ref=eda
C1 C18-C21 C24-C26 = mfpassives:CAPACITOR_NP: Library: MF_Passives Description: Device for Non-Polarized Capacitors. Manufacture part number (MPN) can be added via Attributes. Check https://factory.macrofab.com/parts for the house parts list.; POPULATE: 0
C2 = mfpassives:CAPACITOR_NP: Library: MF_Passives Description: Device for Non-Polarized Capacitors. Manufacture part number (MPN) can be added via Attributes. Check https://factory.macrofab.com/parts for the house parts list.; MF: MURATA; MPN: GCM21BC72A105KE36L; POPULATE: 1
C3 C16 C17 C22 C23 = mfpassives:CAPACITOR_NP: Library: MF_Passives Description: Device for Non-Polarized Capacitors. Manufacture part number (MPN) can be added via Attributes. Check https://factory.macrofab.com/parts for the house parts list.; HOUSEPART: 1; MPN: MF-CAP-0603-1uF; POPULATE: 1
C4 C13 = mfpassives:CAPACITOR_NP: Library: MF_Passives Description: Device for Non-Polarized Capacitors. Manufacture part number (MPN) can be added via Attributes. Check https://factory.macrofab.com/parts for the house parts list.; HOUSEPART: 1; MPN: MF-CAP-1206-10uF; POPULATE: 1
C5 C10 C34 C36 C37 = mfpassives:CAPACITOR_NP: Library: MF_Passives Description: Device for Non-Polarized Capacitors. Manufacture part number (MPN) can be added via Attributes. Check https://factory.macrofab.com/parts for the house parts list.; HOUSEPART: 1; MPN: MF-CAP-0402-1uF; POPULATE: 1
C6 = mfpassives:CAPACITOR_NP: Library: MF_Passives Description: Device for Non-Polarized Capacitors. Manufacture part number (MPN) can be added via Attributes. Check https://factory.macrofab.com/parts for the house parts list.; MF: Samsung; MPN: CL31B226KPHNNNE; POPULATE: 1
C7-C9 C11 C12 C14 C15 C28 C29 C38 = mfpassives:CAPACITOR_NP: Library: MF_Passives Description: Device for Non-Polarized Capacitors. Manufacture part number (MPN) can be added via Attributes. Check https://factory.macrofab.com/parts for the house parts list.; HOUSEPART: 1; MPN: MF-CAP-0402-0.1uF; POPULATE: 1
C27 = mfpassives:CAPACITOR_NP: Library: MF_Passives Description: Device for Non-Polarized Capacitors. Manufacture part number (MPN) can be added via Attributes. Check https://factory.macrofab.com/parts for the house parts list.; HOUSEPART: 1; MPN: MF-CAP-0402-0.01uF; POPULATE: 1
C30-C32 = mfpassives:CAPACITOR_NP: Library: MF_Passives Description: Device for Non-Polarized Capacitors. Manufacture part number (MPN) can be added via Attributes. Check https://factory.macrofab.com/parts for the house parts list.; HOUSEPART: 1; MPN: MF-CAP-0402-1nF; POPULATE: 1
C33 C35 = mfpassives:CAPACITOR_NP: Library: MF_Passives Description: Device for Non-Polarized Capacitors. Manufacture part number (MPN) can be added via Attributes. Check https://factory.macrofab.com/parts for the house parts list.; MF: MURATA; MPN: GCJ188R72A104KA01D; POPULATE: 1
C39 = mfpassives:CAPACITOR_NP: Library: MF_Passives Description: Device for Non-Polarized Capacitors. Manufacture part number (MPN) can be added via Attributes. Check https://factory.macrofab.com/parts for the house parts list.; MF: KYOCERA; MPN: 08051C474KAT2A; POPULATE: 1
C40-C42 = mfpassives:CAPACITOR_NP: Library: MF_Passives Description: Device for Non-Polarized Capacitors. Manufacture part number (MPN) can be added via Attributes. Check https://factory.macrofab.com/parts for the house parts list.; MF: KYOCERA AVX; MPN: 12061C104KAT2A; POPULATE: 1
C43 C44 = EEH-ZU1J101P:EEH-ZU1J101P: Source: Datasheet <http://industrial.panasonic.com/cdbs/www-data/pdf/RDD0000/ast-ind-156944.pdf>; HEIGHT: 12.8mm; MANUFACTURER_NAME: Panasonic; MANUFACTURER_PART_NUMBER: EEH-ZU1J101V; MF: Panasonic; MPN: EEH-ZU1J101V; POPULATE: 1
C45-C47 = mfpassives:CAPACITOR_NP: Library: MF_Passives Description: Device for Non-Polarized Capacitors. Manufacture part number (MPN) can be added via Attributes. Check https://factory.macrofab.com/parts for the house parts list.; MF: MURATA; MPN: GRJ31CC72A475KE01K; POPULATE: 1
C48-C60 = moteus_hp:CAPACITOR_NP; MF: MURATA; MPN: GRJ31CC72A475KE01K; POPULATE: 0
CAN1 = controller:JST-PH3; MF: JST; MPN: S3B-PH-SM4-TB(LF)(SN); POPULATE: 1
CAN2 = controller:JST-PH3; MF: JST; MPN: S3B-PH-SM4-TB(LF)(SN); POPULATE: 0
D1 = mfleds:LED_SINGLE: Library: MF_LEDs Description: Device for Single LED Packages. Manufacture part number (MFG#) can be added via Attributes.; HOUSEPART: 1; MPN: MF-LED-0603-RED; POPULATE: 1; URL: https://factory.macrofab.com/part/MF-LED-0603-RED
D2 = mfleds:LED_SINGLE: Library: MF_LEDs Description: Device for Single LED Packages. Manufacture part number (MFG#) can be added via Attributes.; HOUSEPART: 1; MPN: MF-LED-0603-GREEN; POPULATE: 1; URL: https://factory.macrofab.com/part/MF-LED-0603-RED
D3-D11 = BAT41KFILM:BAT41KFILM: STMicroelectronics 100V 200mA, Diode, 2-Pin SOD-523 BAT41KFILM Source: Datasheet <https://www.st.com/resource/en/datasheet/bat41.pdf>; DESCRIPTION: STMicroelectronics 100V 200mA, Diode, 2-Pin SOD-523 BAT41KFILM; HEIGHT: 0.7mm; MANUFACTURER_NAME: STMicroelectronics; MANUFACTURER_PART_NUMBER: BAT41KFILM; MF: ST; MOUSER_PART_NUMBER: 511-BAT41KFILM; MOUSER_PRICE-STOCK: https://www.mouser.co.uk/ProductDetail/STMicroelectronics/BAT41KFILM?qs=jZi1jxfVU94ZzsUNeiIqGg%3D%3D; MPN: BAT41KFILM; POPULATE: 1
D12 = diode:DIODE-: DIODE; MF: LITTLEFUSE; MPN: TPSMB51A-VR; POPULATE: 1
D33 D50 DAC DG1 DTR DTX MOT1-MOT3 TEMP1 TEMP2 = controller:PAD; POPULATE: 0
J1 = controller:XT30; MPN: XT30PW-M; POPULATE: 1
J2 = controller:XT30; MPN: XT30PW-M; POPULATE: 0
L1 = controller:SRN4018-220M; MANUFACTURER_PART_NUMBER: 74404042470; MF: Wurth Electronics; MPN: 74404042470; POPULATE: 1; VENDOR: Wurth
L2 = moteus_hp:74404024100; COPYRIGHT: Copyright (C) 2022 Ultra Librarian. All rights reserved.; DIGI-KEY_PART_NUMBER_1: 732-5428-2-ND; DIGI-KEY_PART_NUMBER_2: 732-5428-1-ND; DIGI-KEY_PART_NUMBER_3: 732-5428-6-ND; MANUFACTURER_PART_NUMBER: 74404024100; MF: Wurth Electronics; MFR_NAME: Wurth Electronics; MPN: 74404024100; POPULATE: 1
M1-M4 = controller:MOUNT; POPULATE: 0
Q1 Q3 Q5 = moteus_hp:TPH1R204PL; MF: Toshiba; MPN: TPH2R408QM,L1Q; POPULATE: 1
Q2 Q4 Q6 = controller:TPH1R204PL; MF: Toshiba; MPN: TPH2R408QM,L1Q; POPULATE: 1
R1 R2 = mfpassives:RESISTOR: Library: MF_Passives Description: Device for Resistors. Manufacture part number (MPN), Voltage, Tolerance, and Wattage Rating can be added via Attributes. Check https://factory.macrofab.com/parts for the house parts list.; POPULATE: 0
R3 R15 = mfpassives:RESISTOR: Library: MF_Passives Description: Device for Resistors. Manufacture part number (MPN), Voltage, Tolerance, and Wattage Rating can be added via Attributes. Check https://factory.macrofab.com/parts for the house parts list.; MF: Yageo; MPN: RC0402FR-07100KL; POPULATE: 1
R4 R5 R8-R14 = mfpassives:RESISTOR: Library: MF_Passives Description: Device for Resistors. Manufacture part number (MPN), Voltage, Tolerance, and Wattage Rating can be added via Attributes. Check https://factory.macrofab.com/parts for the house parts list.; HOUSEPART: 1; MPN: MF-RES-0402-100; POPULATE: 1
R6 R7 R25 R26 = mfpassives:RESISTOR: Library: MF_Passives Description: Device for Resistors. Manufacture part number (MPN), Voltage, Tolerance, and Wattage Rating can be added via Attributes. Check https://factory.macrofab.com/parts for the house parts list.; HOUSEPART: 1; MPN: MF-RES-0402-2K; POPULATE: 1
R16 = mfpassives:RESISTOR: Library: MF_Passives Description: Device for Resistors. Manufacture part number (MPN), Voltage, Tolerance, and Wattage Rating can be added via Attributes. Check https://factory.macrofab.com/parts for the house parts list.; MF: Yageo; MPN: RC0402FR-074K7L; POPULATE: 1
R17 = mfpassives:RESISTOR: Library: MF_Passives Description: Device for Resistors. Manufacture part number (MPN), Voltage, Tolerance, and Wattage Rating can be added via Attributes. Check https://factory.macrofab.com/parts for the house parts list.; MF: Murata; MPN: NCP15WB473F03RC; POPULATE: 1
R18 R19 = mfpassives:RESISTOR: Library: MF_Passives Description: Device for Resistors. Manufacture part number (MPN), Voltage, Tolerance, and Wattage Rating can be added via Attributes. Check https://factory.macrofab.com/parts for the house parts list.; MF: Yageo; MPN: RC0402FR-0710KL; POPULATE: 1
R20 R21 = mfpassives:RESISTOR: Library: MF_Passives Description: Device for Resistors. Manufacture part number (MPN), Voltage, Tolerance, and Wattage Rating can be added via Attributes. Check https://factory.macrofab.com/parts for the house parts list.; HOUSEPART: 1; MPN: MF-RES-0402-560; POPULATE: 1
R22-R24 = mfpassives:RESISTOR: Library: MF_Passives Description: Device for Resistors. Manufacture part number (MPN), Voltage, Tolerance, and Wattage Rating can be added via Attributes. Check https://factory.macrofab.com/parts for the house parts list.; HOUSEPART: 1; MPN: MF-RES-0402-22; POPULATE: 1
R27 R28 R30-R32 = mfpassives:RESISTOR: Library: MF_Passives Description: Device for Resistors. Manufacture part number (MPN), Voltage, Tolerance, and Wattage Rating can be added via Attributes. Check https://factory.macrofab.com/parts for the house parts list.; HOUSEPART: 1; MPN: RC0402FR-077R5L; POPULATE: 1
R29 = mfpassives:RESISTOR: Library: MF_Passives Description: Device for Resistors. Manufacture part number (MPN), Voltage, Tolerance, and Wattage Rating can be added via Attributes. Check https://factory.macrofab.com/parts for the house parts list.; MF: Yageo; MPN: RC0805FR-077R5L; POPULATE: 1
RA RB RC = rcl:R-US_: RESISTOR, American symbol; MF: Stackpole Electronics; MPN: HCS1206FTL500; POPULATE: 1
SH1-SH3 = shorts:SHORT: Short between two nets; BOM: no; POPULATE: 0
SH4 = shorts:SHORT: Short between two nets; POPULATE: 0
SWD = controller:JST-ZH6; MF: JST; MPN: S6B-ZR-SM4A-TF(LF)(SN); POPULATE: 1
U1 = power_dist:MAX15062AATA+T; BUILT_BY: EMA_Jessica; COPYRIGHT: Copyright (C) 2018 Accelerated Designs. All rights reserved; MANUFACTURER_PART_NUMBER: MAX15062BATA+T; MF: Maxim; MPN: MAX15062BATA+T; POPULATE: 1; REVISION: 1; SOURCELIBRARY: Maxim_DP_2018-06-12; VENDOR: Maxim Integrated Products
U2 = XC9265A331MR-G:XC9265A331MR-G: Switching Voltage Regulators Ultra Low Power PFM DCDC Converter Source: Datasheet <https://www.torexsemi.com/file/xc9265/XC9265.pdf>; DESCRIPTION: Switching Voltage Regulators Ultra Low Power PFM DCDC Converter; HEIGHT: 1.3mm; MANUFACTURER_NAME: Torex; MANUFACTURER_PART_NUMBER: XC9265A331MR-G; MF: Torex; MOUSER_PART_NUMBER: 865-XC9265A331MR-G; MOUSER_PRICE-STOCK: https://www.mouser.co.uk/ProductDetail/Torex-Semiconductor/XC9265A331MR-G?qs=AsjdqWjXhJ9U1u7bKcUHSA%3D%3D; MPN: XC9265A331MR-G; POPULATE: 1
U3 = controller:STM32G474CEU6: STMICROELECTRONICS - STM32G474CEU6 - MCU, 32BIT, 170MHZ, UFQFPN-48 Source: Datasheet <https://componentsearchengine.com/Datasheets/1/STM32G474CEU6.pdf>; DESCRIPTION: STMICROELECTRONICS - STM32G474CEU6 - MCU, 32BIT, 170MHZ, UFQFPN-48; HEIGHT: 0.6mm; MANUFACTURER_NAME: STMicroelectronics; MANUFACTURER_PART_NUMBER: STM32G474CEU6; MOUSER_PART_NUMBER: 511-STM32G474CEU6; MOUSER_PRICE-STOCK: https://www.mouser.com/Search/Refine.aspx?Keyword=511-STM32G474CEU6; MPN: STM32G474CEU6; POPULATE: 1
U4 = moteus_hp:TCAN1042HGV; MF: TI; MPN: TCAN1057AEVDRQ1‎; POPULATE: 1
U5 = controller:AS5147; MF: AMS; MPN: AS5047P-ATSM; POPULATE: 1
U6 = moteus_hp:CAT25080HU4I-GT3; COPYRIGHT: Copyright (C) 2022 Ultra Librarian. All rights reserved.; DIGI-KEY_PART_NUMBER_1: 2156-CAT25080HU4I-GT3-OS-ND; DIGI-KEY_PART_NUMBER_2: CAT25080HU4I-GT3-ND; DIGI-KEY_PART_NUMBER_3: CAT25080HU4I-GT3OSCT-ND; DIGI-KEY_PART_NUMBER_4: CAT25080HU4I-GT3OSDKR-ND; DIGI-KEY_PART_NUMBER_5: CAT25080HU4I-GT3OSTR-ND; MANUFACTURER_PART_NUMBER: CAT25080HU4I-GT3; MF: onsemi; MFR_NAME: onsemi; MPN: CAT24C32HU4I-GT3; POPULATE: 1
U7 = controller:DRV8353S; MF: TI; MPN: DRV8353FSRTAR; POPULATE: 1

## Net classes
0 default: width 0.127 mm
1 CAN: width 0.216 mm, clearance 0.127 mm
2 HV: clearance 0.13 mm
3 GATE: width 0.384 mm